# Altium project 7797-20-0224.PrjPcb
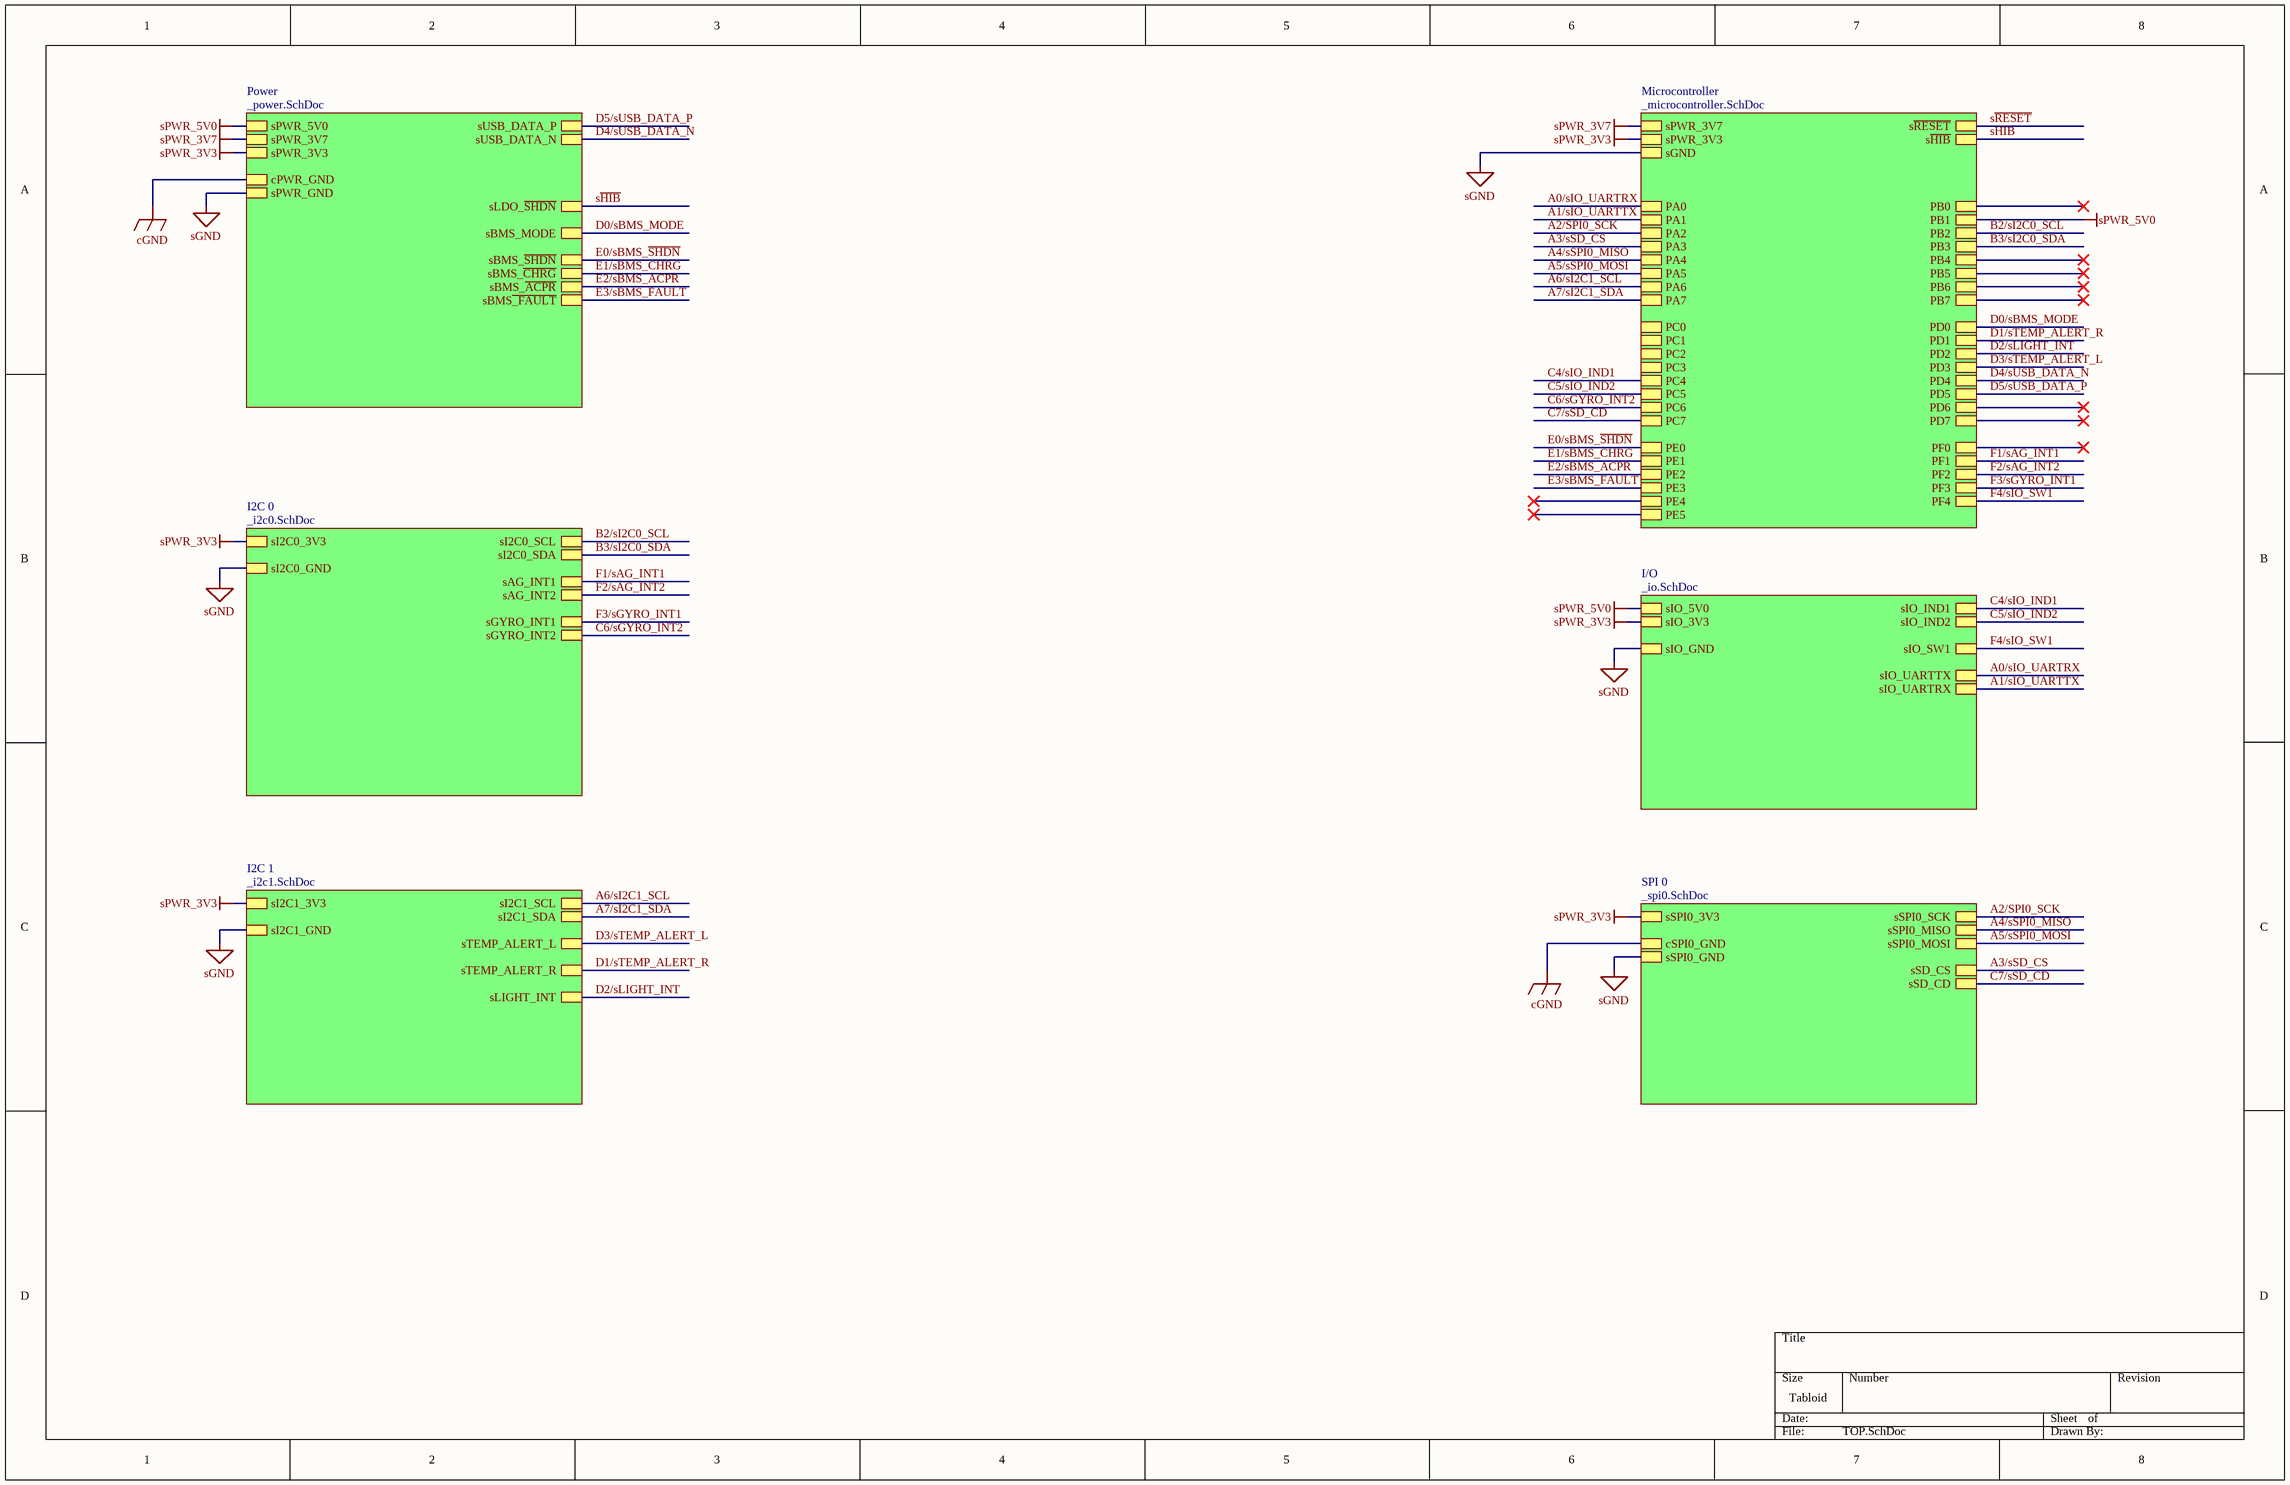
[diagram p0: TOP.SchDoc]
12 sheets, 114 parts. Net scope: strictly hierarchical (ports join the sheet entries above them; power ports are local).
Board file: 7797-20-0224.PcbDoc
Sheets:
  TOP.SchDoc
    Microcontroller = _microcontroller.SchDoc
    Power = _power.SchDoc
    I2C 0 = _i2c0.SchDoc
      Accelerometer and Mangnetometer = _accel_mag.SchDoc
      Gyroscope = _gyroscope.SchDoc
    I2C 1 = _i2c1.SchDoc
      Light And Humidity = _light_humid.SchDoc
      Temperature Left = _temperature.SchDoc
      Temperature Right = _temperature.SchDoc
    I/O = _io.SchDoc
    SPI 0 = _spi0.SchDoc
      Micro SD = _microsd.SchDoc

## Sheet TOP.SchDoc
size Tabloid

### Sub-sheets
I2C 0 = _i2c0.SchDoc: sI2C0_3V3, sI2C0_GND, sI2C0_SCL, sI2C0_SDA, sAG_INT1, sAG_INT2, sGYRO_INT1, sGYRO_INT2
I2C 1 = _i2c1.SchDoc: sI2C1_3V3, sI2C1_GND, sTEMP_ALERT_L, sLIGHT_INT, sTEMP_ALERT_R, sI2C1_SCL, sI2C1_SDA
I/O = _io.SchDoc: sIO_3V3, sIO_GND, sIO_IND1, sIO_IND2, sIO_SW1, sIO_5V0, sIO_UARTTX, sIO_UARTRX
Microcontroller = _microcontroller.SchDoc: s~{RESET}, PA0, PA1, PA2, PA3, PA4, PA5, PA6, PA7, PC0, PC1, PC2, PC3, PC4, PC5, PC6, PC7, PE0, PE1, PE2, PE3, PE4, PE5, PB0, PB1, PB2, PB3, PB4, PB5, PB6, PB7, PD0, PD1, PD2, PD3, PD4, PD5, PD6, PD7, PF0, PF1, PF2, PF3, PF4, sGND, sPWR_3V3, s~{HIB}, sPWR_3V7
Power = _power.SchDoc: sUSB_DATA_P, sUSB_DATA_N, sPWR_3V7, sPWR_3V3, sPWR_GND, cPWR_GND, sPWR_5V0, sLDO_~{SHDN}, sBMS_MODE, sBMS_~{SHDN}, sBMS_~{CHRG}, sBMS_~{ACPR}, sBMS~{_FAULT}
SPI 0 = _spi0.SchDoc: sSPI0_3V3, sSPI0_GND, sSPI0_MISO, sSPI0_MOSI, sSPI0_SCK, cSPI0_GND, sSD_CS, sSD_CD

### Nets
cGND: sheet Power/cPWR_GND, sheet SPI 0/cSPI0_GND
sGND: sheet Microcontroller/sGND, sheet Power/sPWR_GND, sheet I2C 0/sI2C0_GND, sheet I2C 1/sI2C1_GND, sheet I/O/sIO_GND, sheet SPI 0/sSPI0_GND
sPWR_3V3: sheet Microcontroller/sPWR_3V3, sheet Power/sPWR_3V3, sheet I2C 0/sI2C0_3V3, sheet I2C 1/sI2C1_3V3, sheet I/O/sIO_3V3, sheet SPI 0/sSPI0_3V3
sPWR_3V7: sheet Microcontroller/sPWR_3V7, sheet Power/sPWR_3V7
sPWR_5V0: sheet Microcontroller/PB1, sheet Power/sPWR_5V0, sheet I/O/sIO_5V0
A0/sIO_UARTRX: sheet Microcontroller/PA0, sheet I/O/sIO_UARTTX
A1/sIO_UARTTX: sheet Microcontroller/PA1, sheet I/O/sIO_UARTRX
A2/SPI0_SCK: sheet Microcontroller/PA2, sheet SPI 0/sSPI0_SCK
A3/sSD_CS: sheet Microcontroller/PA3, sheet SPI 0/sSD_CS
A4/sSPI0_MISO: sheet Microcontroller/PA4, sheet SPI 0/sSPI0_MISO
A5/sSPI0_MOSI: sheet Microcontroller/PA5, sheet SPI 0/sSPI0_MOSI
A6/sI2C1_SCL: sheet Microcontroller/PA6, sheet I2C 1/sI2C1_SCL
A7/sI2C1_SDA: sheet Microcontroller/PA7, sheet I2C 1/sI2C1_SDA
B2/sI2C0_SCL: sheet Microcontroller/PB2, sheet I2C 0/sI2C0_SCL
B3/sI2C0_SDA: sheet Microcontroller/PB3, sheet I2C 0/sI2C0_SDA
C4/sIO_IND1: sheet Microcontroller/PC4, sheet I/O/sIO_IND1
C5/sIO_IND2: sheet Microcontroller/PC5, sheet I/O/sIO_IND2
C6/sGYRO_INT2: sheet Microcontroller/PC6, sheet I2C 0/sGYRO_INT2
C7/sSD_CD: sheet Microcontroller/PC7, sheet SPI 0/sSD_CD
D0/sBMS_MODE: sheet Microcontroller/PD0, sheet Power/sBMS_MODE
D1/sTEMP_ALERT_R: sheet Microcontroller/PD1, sheet I2C 1/sTEMP_ALERT_R
D2/sLIGHT_INT: sheet Microcontroller/PD2, sheet I2C 1/sLIGHT_INT
D3/sTEMP_ALERT_L: sheet Microcontroller/PD3, sheet I2C 1/sTEMP_ALERT_L
D4/sUSB_DATA_N: sheet Microcontroller/PD4, sheet Power/sUSB_DATA_N
D5/sUSB_DATA_P: sheet Microcontroller/PD5, sheet Power/sUSB_DATA_P
E0/sBMS_~{SHDN}: sheet Microcontroller/PE0, sheet Power/sBMS_~{SHDN}
E1/sBMS_~{CHRG}: sheet Microcontroller/PE1, sheet Power/sBMS_~{CHRG}
E2/sBMS_~{ACPR}: sheet Microcontroller/PE2, sheet Power/sBMS_~{ACPR}
E3/sBMS~{_FAULT}: sheet Microcontroller/PE3, sheet Power/sBMS~{_FAULT}
F1/sAG_INT1: sheet Microcontroller/PF1, sheet I2C 0/sAG_INT1
F2/sAG_INT2: sheet Microcontroller/PF2, sheet I2C 0/sAG_INT2
F3/sGYRO_INT1: sheet Microcontroller/PF3, sheet I2C 0/sGYRO_INT1
F4/sIO_SW1: sheet Microcontroller/PF4, sheet I/O/sIO_SW1
s~{HIB}: sheet Microcontroller/s~{HIB}, sheet Power/sLDO_~{SHDN}

## Sheet _microcontroller.SchDoc
size Tabloid
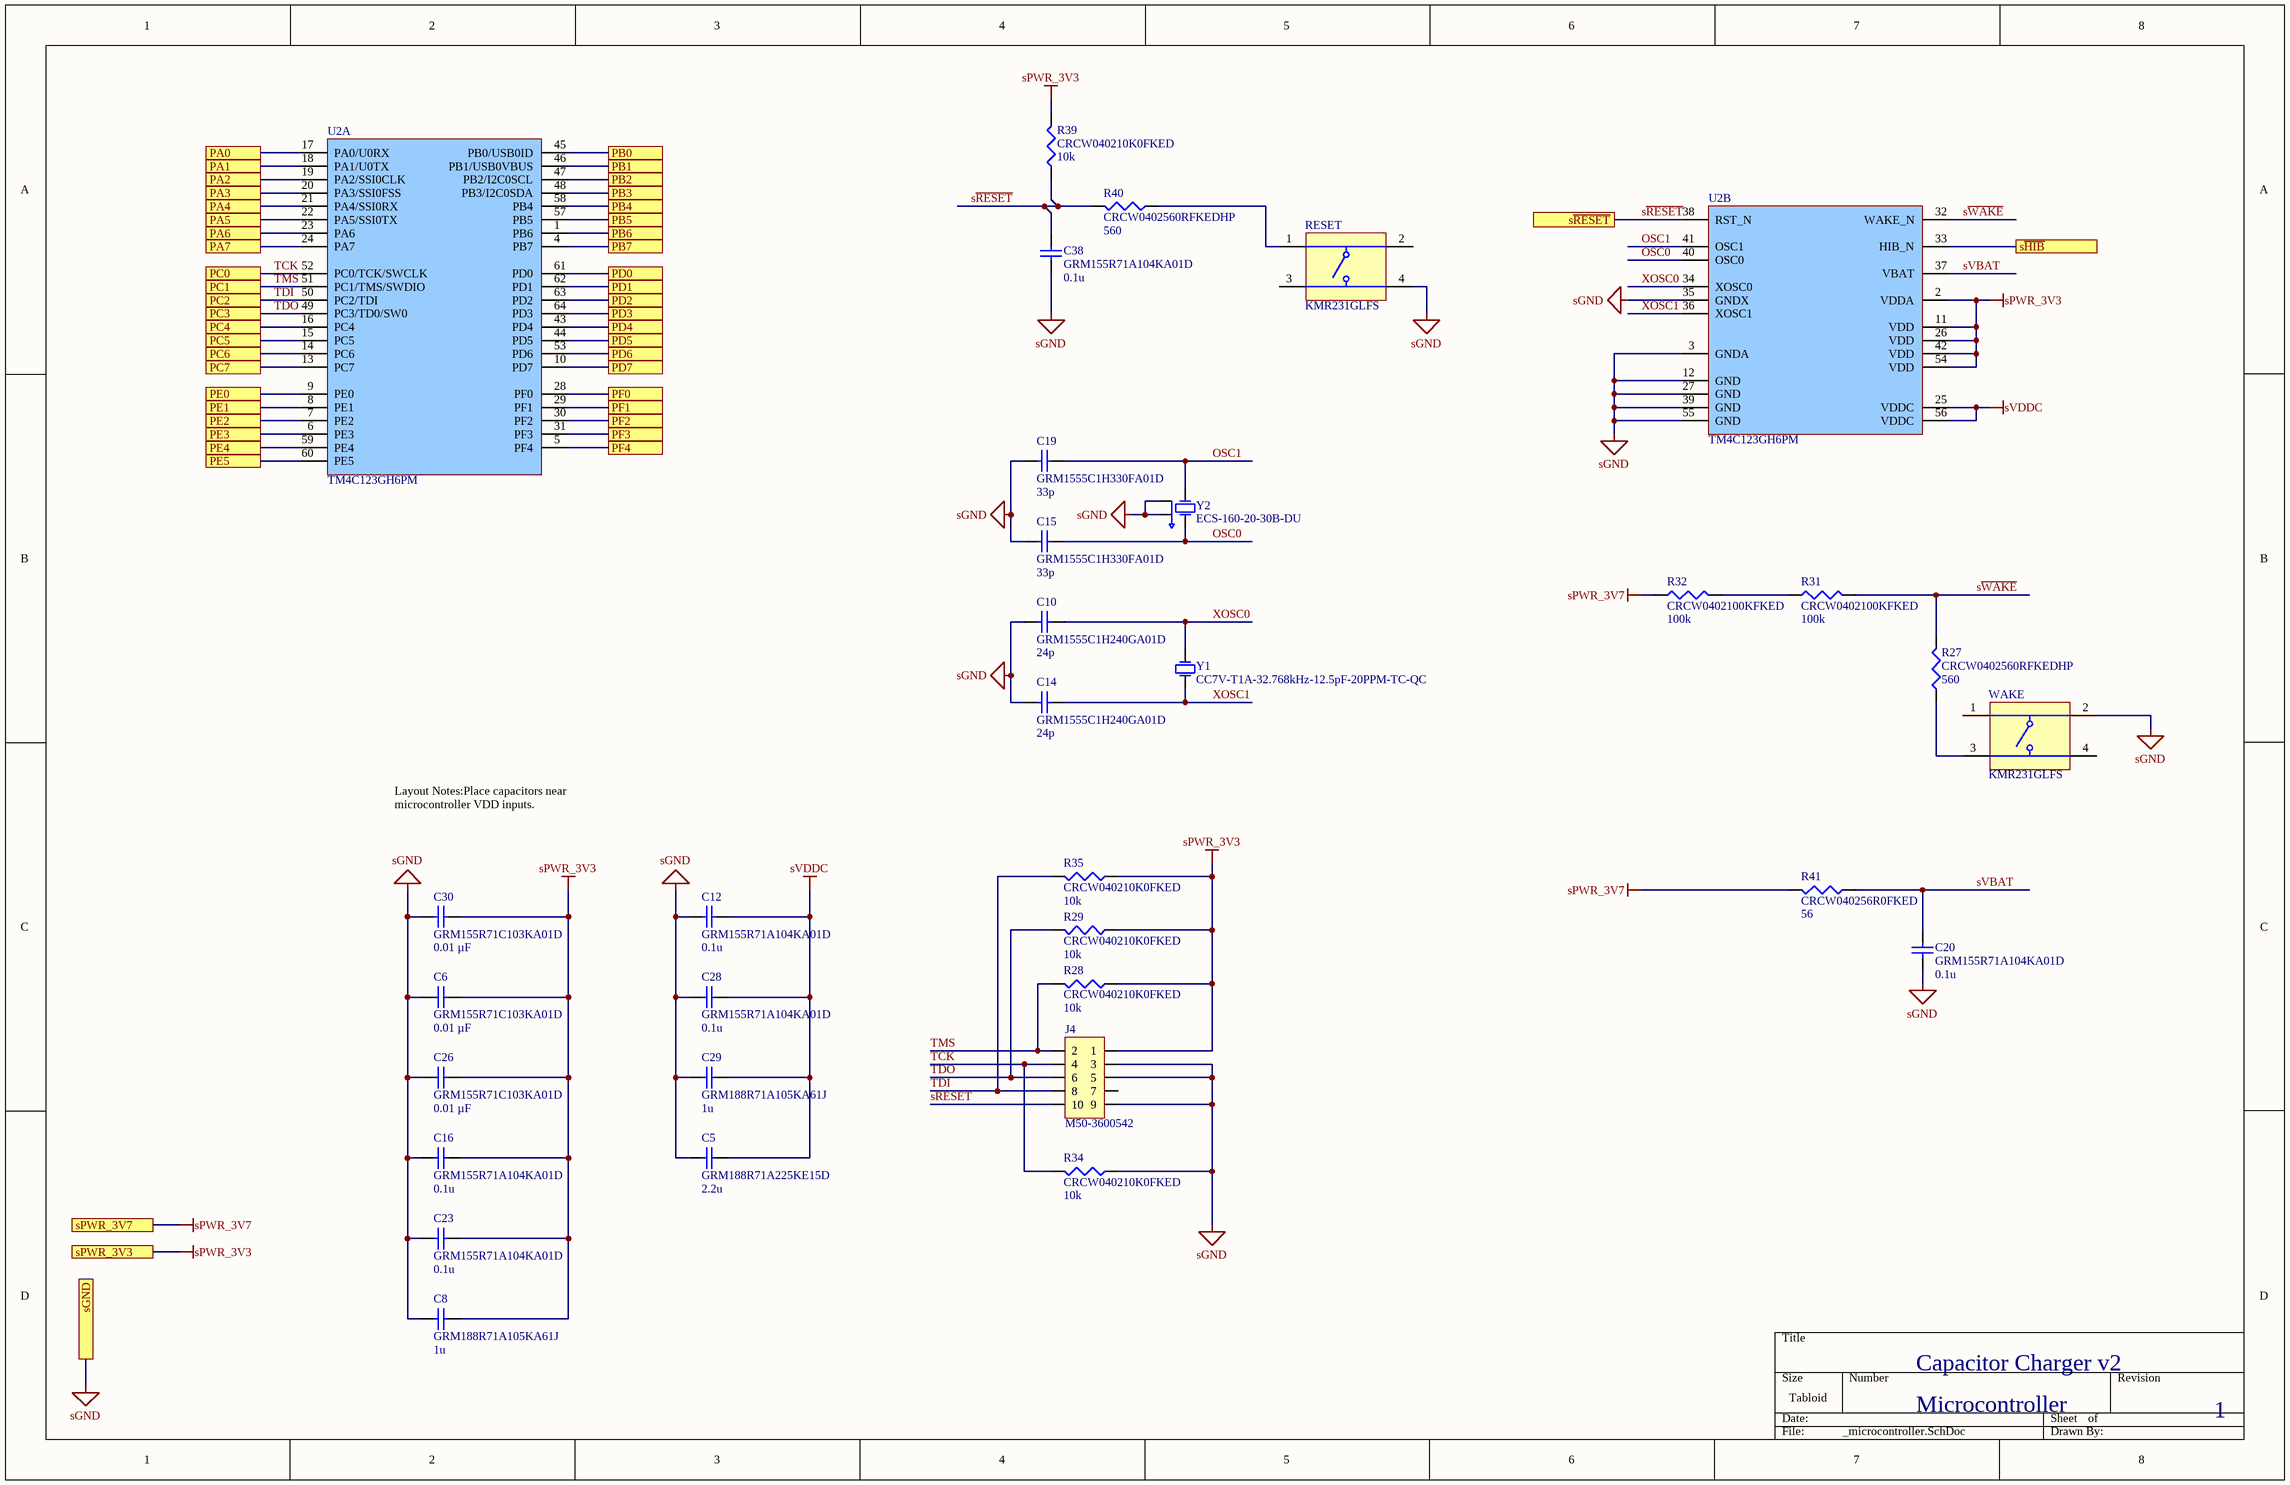
[diagram p1: _microcontroller.SchDoc]

### Parts
(Parts that share a designator on the sheet are numbered #1, #2 ... from top to bottom, then left to right.)
C5  GRM188R71A225KE15D  value 2.2u  [0603]
C6  GRM155R71C103KA01D  value 0.01 µF  [0402]
C8  GRM188R71A105KA61J  value 1u  [0603]
C10  GRM1555C1H240GA01D  value 24p  [0402]
C12  GRM155R71A104KA01D  value 0.1u  [0402]
C14  GRM1555C1H240GA01D  value 24p  [0402]
C15  GRM1555C1H330FA01D  value 33p  [0402]
C16  GRM155R71A104KA01D  value 0.1u  [0402]
C19  GRM1555C1H330FA01D  value 33p  [0402]
C20  GRM155R71A104KA01D  value 0.1u  [0402]
C23  GRM155R71A104KA01D  value 0.1u  [0402]
C26  GRM155R71C103KA01D  value 0.01 µF  [0402]
C28  GRM155R71A104KA01D  value 0.1u  [0402]
C29  GRM188R71A105KA61J  value 1u  [0603]
C30  GRM155R71C103KA01D  value 0.01 µF  [0402]
C38#1  GRM155R71A104KA01D  value 0.1u  [0402]
J4  M50-3600542  [M50-3600542]
R27  CRCW0402560RFKEDHP  value 560  [0402]
R28  CRCW040210K0FKED  value 10k  [0402]
R29  CRCW040210K0FKED  value 10k  [0402]
R31  CRCW0402100KFKED  value 100k  [0402]
R32  CRCW0402100KFKED  value 100k  [0402]
R34  CRCW040210K0FKED  value 10k  [0402]
R35  CRCW040210K0FKED  value 10k  [0402]
R39  CRCW040210K0FKED  value 10k  [0402]
R40  CRCW0402560RFKEDHP  value 560  [0402]
R41  CRCW040256R0FKED  value 56  [0402]
RESET  KMR231GLFS  [KMR231GLFS]
U2  TM4C123GH6PM  [QFP50P1200X1200X160-64N]  (parts A,B of 2)
WAKE  KMR231GLFS  [KMR231GLFS]
Y1  CC7V-T1A-32.768kHz-12.5pF-20PPM-TC-QC  [CC7V-T1A]
Y2  ECS-160-20-30B-DU  [ECX-53B]

### Ports
PA0, PA1, PA2, PA3, PA4, PA5, PA6, PA7, PB0, PB1, PB2, PB3, PB4, PB5, PB6, PB7, PC0, PC1, PC2, PC3, PC4, PC5, PC6, PC7, PD0, PD1, PD2, PD3, PD4, PD5, PD6, PD7, PE0, PE1, PE2, PE3, PE4, PE5, PF0, PF1, PF2, PF3, PF4, sGND, sPWR_3V3, sPWR_3V7, s~{HIB}, s~{RESET}

### Nets
sGND: C5.2 C6.2 C8.2 C10.1 C12.2 C14.1 C15.1 C16.2 C19.1 C20.2 C23.2 C26.2 C28.2 C29.2 C30.2 C38#1.2 J4.3 J4.5 J4.9 R34.1 RESET.4 U2.3(GNDA) U2.12(GND) U2.27(GND) U2.35(GNDX) U2.39(GND) U2.55(GND) WAKE.2 Y2.2 Y2.4 ; port sGND
sPWR_3V3: C6.1 C8.1 C16.1 C23.1 C26.1 C30.1 J4.1 R28.1 R29.1 R35.1 R39.2 U2.2(VDDA) U2.11(VDD) U2.26(VDD) U2.42(VDD) U2.54(VDD) ; port sPWR_3V3
sPWR_3V7: R32.1 R41.2 ; port sPWR_3V7
sPWR_5V0: U2.46(PB1/USB0VBUS) ; port PB1
sVDDC: C5.1 C12.1 C28.1 C29.1 U2.25(VDDC) U2.56(VDDC)
A0/sIO_UARTRX: U2.17(PA0/U0RX) ; port PA0
A1/sIO_UARTTX: U2.18(PA1/U0TX) ; port PA1
A2/SPI0_SCK: U2.19(PA2/SSI0CLK) ; port PA2
A3/sSD_CS: U2.20(PA3/SSI0FSS) ; port PA3
A4/sSPI0_MISO: U2.21(PA4/SSI0RX) ; port PA4
A5/sSPI0_MOSI: U2.22(PA5/SSI0TX) ; port PA5
A6/sI2C1_SCL: U2.23(PA6) ; port PA6
A7/sI2C1_SDA: U2.24(PA7) ; port PA7
B2/sI2C0_SCL: U2.47(PB2/I2C0SCL) ; port PB2
B3/sI2C0_SDA: U2.48(PB3/I2C0SDA) ; port PB3
C4/sIO_IND1: U2.16(PC4) ; port PC4
C5/sIO_IND2: U2.15(PC5) ; port PC5
C6/sGYRO_INT2: U2.14(PC6) ; port PC6
C7/sSD_CD: U2.13(PC7) ; port PC7
D0/sBMS_MODE: U2.61(PD0) ; port PD0
D1/sTEMP_ALERT_R: U2.62(PD1) ; port PD1
D2/sLIGHT_INT: U2.63(PD2) ; port PD2
D3/sTEMP_ALERT_L: U2.64(PD3) ; port PD3
D4/sUSB_DATA_N: U2.43(PD4) ; port PD4
D5/sUSB_DATA_P: U2.44(PD5) ; port PD5
E0/sBMS_~{SHDN}: U2.9(PE0) ; port PE0
E1/sBMS_~{CHRG}: U2.8(PE1) ; port PE1
E2/sBMS_~{ACPR}: U2.7(PE2) ; port PE2
E3/sBMS~{_FAULT}: U2.6(PE3) ; port PE3
F1/sAG_INT1: U2.29(PF1) ; port PF1
F2/sAG_INT2: U2.30(PF2) ; port PF2
F3/sGYRO_INT1: U2.31(PF3) ; port PF3
F4/sIO_SW1: U2.5(PF4) ; port PF4
OSC0: C15.2 U2.40(OSC0) Y2.3
OSC1: C19.2 U2.41(OSC1) Y2.1
PB0: U2.45(PB0/USB0ID) ; port PB0
PB4: U2.58(PB4) ; port PB4
PB5: U2.57(PB5) ; port PB5
PB6: U2.1(PB6) ; port PB6
PB7: U2.4(PB7) ; port PB7
PD6: U2.53(PD6) ; port PD6
PD7: U2.10(PD7) ; port PD7
PE4: U2.59(PE4) ; port PE4
PE5: U2.60(PE5) ; port PE5
PF0: U2.28(PF0) ; port PF0
s~{HIB}: U2.33(HIB_N) ; port s~{HIB}
s~{RESET}: C38#1.1 J4.10 R39.1 R40.2 U2.38(RST_N) ; port s~{RESET}
sVBAT: C20.1 R41.1 U2.37(VBAT)
s~{WAKE}: R27.2 R31.2 U2.32(WAKE_N)
TCK: J4.4 R34.2 U2.52(PC0/TCK/SWCLK) ; port PC0
TDI: J4.8 R35.2 U2.50(PC2/TDI) ; port PC2
TDO: J4.6 R29.2 U2.49(PC3/TD0/SW0) ; port PC3
TMS: J4.2 R28.2 U2.51(PC1/TMS/SWDIO) ; port PC1
XOSC0: C10.2 U2.34(XOSC0) Y1.1
XOSC1: C14.2 U2.36(XOSC1) Y1.2
NetR27_1: R27.1 WAKE.3
NetR31_1: R31.1 R32.2
NetR40_1: R40.1 RESET.1

Not connected (* = marked no-connect by the designer): J4 7; RESET 2 3; WAKE 1 4

### Notes on the sheet
- Layout Notes:Place capacitors near microcontroller VDD inputs.
- Capacitor Charger v2
- Microcontroller
- 1

### Library data of the parts
C5 C8 C29 = GRM188R71AxxxKdddd: -55-125C, 1608, 10V, X7R, ±10%
C6 C26 C30 = Cap: Cap, 0.01 µF, 16 V, X7R; Published: 8-Jun-2000; LatestRevisionDate: 17-Jul-2002; LatestRevisionNote: Re-released for DXP Platform.; PackageReference: RAD-0.3; Publisher: Altium Limited; PackageDescription: Radial Cap, Thru-Hole; 2 Leads; 0.3 in Pin Spacing
C10 C14 C15 C19 = Cap Semi: Capacitor (Semiconductor SIM Model); Published: 8-Jun-2000; LatestRevisionDate: 29-May-2009; LatestRevisionNote: IPC-7351 Footprint Added.; PackageReference: C1206; Publisher: Altium Limited; PackageDescription: Chip Capacitor
C12 C16 C20 C23 C28 C38#1 = GRM155R71AxxxKdddd: -55-125C, 1005, 10V, X7R, ±10%
R27-R29 R31 R32 R34 R35 R39-R41 = CRCW0402xxxxFKED: 0.125W, -55-155C, 1005, 50V, ±1%
RESET WAKE = KMR231GLFS: Switch Tactile, SPST, 50 mA, 32 V, -40 to 85 degC, 4-Pin SMD, RoHS, Tape and Reel; Manufacturer: C&K Components; Mechanical Life: 150000Cycles; Switch Configuration: N.O.; Actuator Style: Button; Ground Terminal: Yes; Maximum DC Voltage Rating: 32V; Minimum Insulation Resistance: >=1000MOhm; Dielectric Strength: >=250Vrms; Operating Force: 3N; Illumination Type: N/R; Body Orientation: Straight; Contact Rating @ Voltage: 1A; Actuator Length: 0.5mm; Operating Temperature: -40to85C; Electrical Life: N/A; Housing Material: N/A; ECCN: EAR99; Pole Throw Configuration: SPST; Contact Plating: Silver; Dimension: 2.8x4.6x1.9mm; Type: Micro-Miniature; Product Weight: N/A; Package Description: 4-Pin Surface Mount Device, Body 4.6 x 2.8 mm; Actuator Color: N/A; HTS: 8536501199; Mounting Technology: SurfaceMount; Mounting: SurfaceMount,GullWing; Seal Location: N/A; Base Material: N/A; Family: KMR2; Part No: KMR231GLFS; Datasheet Version: 06/2016; Contact Material: Silver; Package Reference: KMR231GLFS; Manufacturer URL: http://www.ckswitches.com/; Maximum AC Voltage Rating: N/A; Datasheet URL: http://www.ck-components.com/media/1479/kmr2.pdf; RoHS: Yes; Seal Description: N/A; Packaging: TapeandReel; Supplier: C&KComponents
U2 = TM4C123GH6PM: Tiva TM4C123GH6PM Microcontroller
Y1 = CC7V-T1A: Crystals 32.768 kHz 12.5 pF +/-20 PPM -55/+125C
Y2 = ECS-160-20-30B-DU: Crystal, 16.000MHz, 20pF, 100ppm, -55 to 125 C, 60 Ω

## Sheet _power.SchDoc
size Tabloid
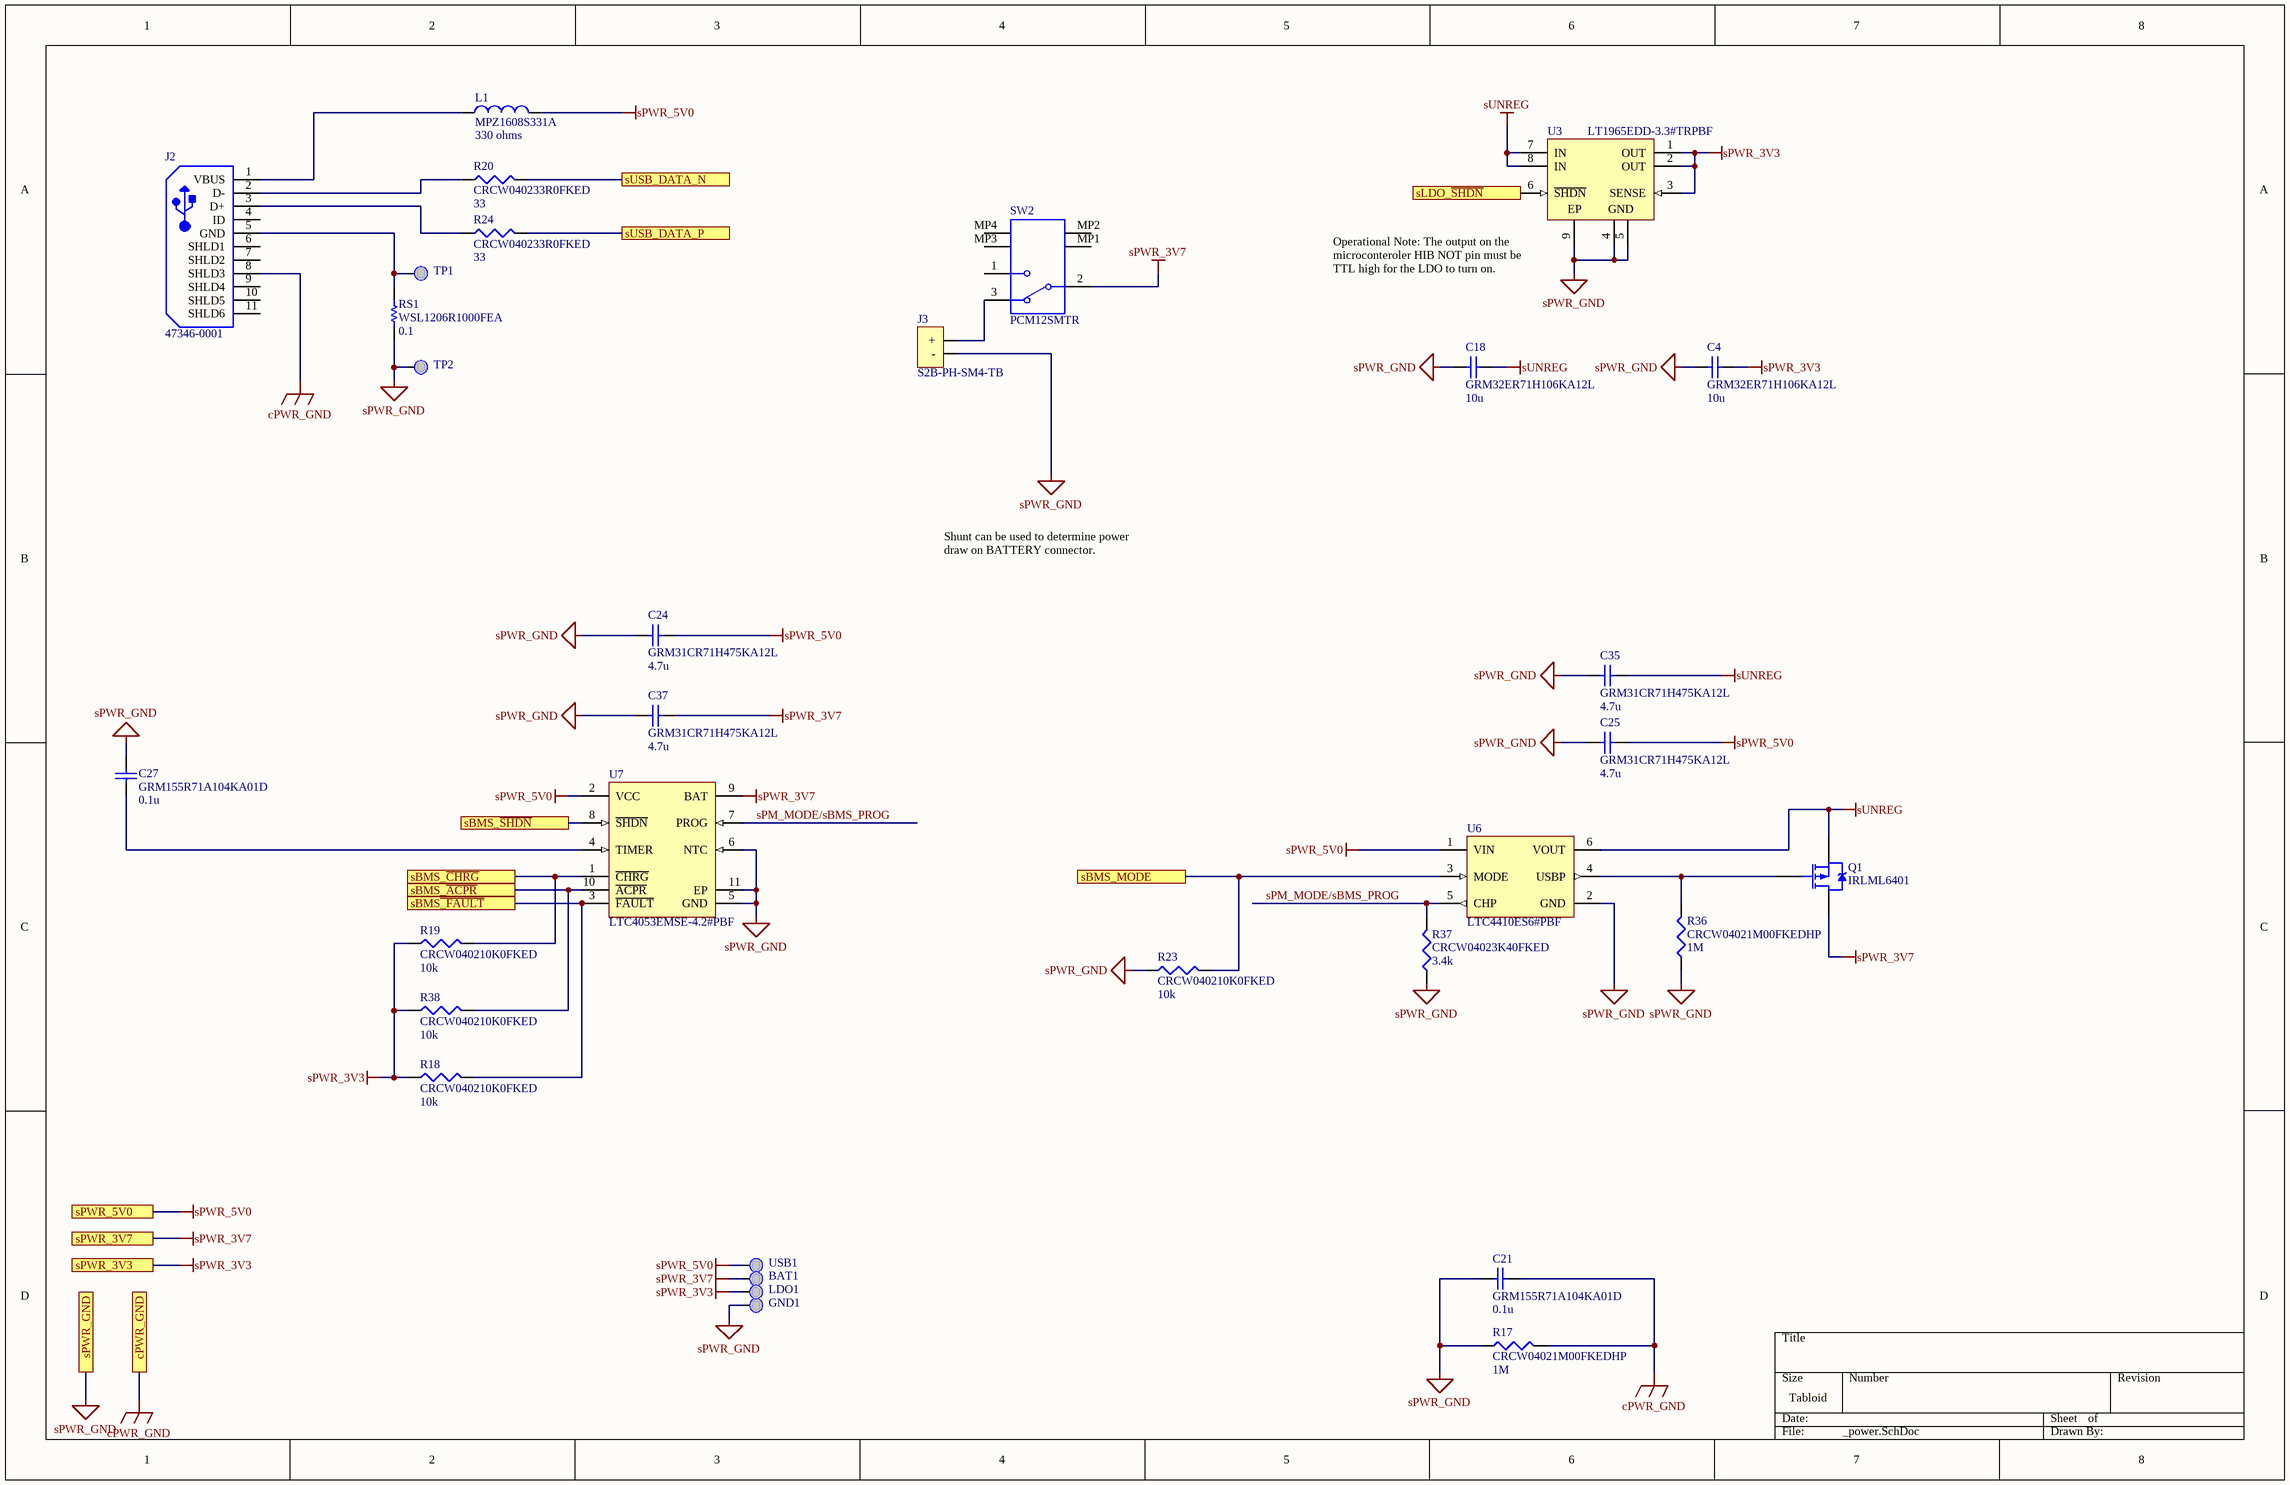
[diagram p2: _power.SchDoc]

### Parts
(Parts that share a designator on the sheet are numbered #1, #2 ... from top to bottom, then left to right.)
BAT1  TP  [TP_TH]  (value not drawn)
C4  GRM32ER71H106KA12L  value 10u  [1210]
C18  GRM32ER71H106KA12L  value 10u  [1210]
C21  GRM155R71A104KA01D  value 0.1u  [0402]
C24  GRM31CR71H475KA12L  value 4.7u  [1206]
C25  GRM31CR71H475KA12L  value 4.7u  [1206]
C27  GRM155R71A104KA01D  value 0.1u  [0402]
C35  GRM31CR71H475KA12L  value 4.7u  [1206]
C37  GRM31CR71H475KA12L  value 4.7u  [1206]
GND1  TP  [TP_TH]  (value not drawn)
J2  47346-0001  [MOLX-47346-0001-5_V]
J3  S2B-PH-SM4-TB  [S2B-PH-SM4-TB]
L1  MPZ1608S331A  value 330 ohms  [1608[0603]]
LDO1  TP  [TP_TH]  (value not drawn)
Q1  IRLML6401  [Micro3_N]
R17  CRCW04021M00FKEDHP  value 1M  [0402]
R18  CRCW040210K0FKED  value 10k  [0402]
R19  CRCW040210K0FKED  value 10k  [0402]
R20  CRCW040233R0FKED  value 33  [0402]
R23  CRCW040210K0FKED  value 10k  [0402]
R24  CRCW040233R0FKED  value 33  [0402]
R36#1  CRCW04021M00FKEDHP  value 1M  [0402]
R37  CRCW04023K40FKED  value 3.4k  [0402]
R38  CRCW040210K0FKED  value 10k  [0402]
RS1  WSL1206R1000FEA  value 0.1  [C1206]
SW2  PCM12SMTR  [CKCP-PCM12SMTR_V]
TP1  TP  [TP_TH]  (value not drawn)
TP2  TP  [TP_TH]  (value not drawn)
U3  LT1965EDD-3.3#TRPBF  [LT-DD-8_V]
U6  LTC4410ES6#PBF  [LT-S6-6-TSOT-23_N]
U7  LTC4053EMSE-4.2#PBF  [LT-MSE-10-EDP-2060x1830TP_N]
USB1  TP  [TP_TH]  (value not drawn)

### Ports
cPWR_GND, sBMS_MODE, sBMS_~{ACPR}, sBMS_~{CHRG}, sBMS_~{SHDN}, sBMS~{_FAULT}, sLDO_~{SHDN}, sPWR_3V3, sPWR_3V7, sPWR_5V0, sPWR_GND, sUSB_DATA_N, sUSB_DATA_P

### Nets
cPWR_GND: C21.2 J2.8(SHLD3) R17.2 ; port cPWR_GND  [project net cGND]
sPWR_3V3: C4.2 LDO1.1 R18.1 R19.1 R38.1 U3.1(OUT) U3.2(OUT) U3.3(SENSE) ; port sPWR_3V3
sPWR_3V7: BAT1.1 C37.2 Q1.3(D) SW2.2 U7.9(BAT) ; port sPWR_3V7
sPWR_5V0: C24.2 C25.2 L1.2 U6.1(VIN) U7.2(VCC) USB1.1 ; port sPWR_5V0
sPWR_GND: C4.1 C18.1 C21.1 C24.1 C25.1 C27.1 C35.1 C37.1 GND1.1 J3.1(-) R17.1 R23.1 R36#1.1 R37.1 RS1.1 TP2.1 U3.4(GND) U3.5(GND) U3.9(EP) U6.2(GND) U7.5(GND) U7.6(NTC) U7.11(EP) ; port sPWR_GND  [project net sGND]
sUNREG: C18.2 C35.2 Q1.2(S) U3.7(IN) U3.8(IN) U6.6(VOUT)
D0/sBMS_MODE: R23.2 U6.3(MODE) ; port sBMS_MODE
D4/sUSB_DATA_N: R20.2 ; port sUSB_DATA_N
D5/sUSB_DATA_P: R24.2 ; port sUSB_DATA_P
E0/sBMS_~{SHDN}: U7.8(~{SHDN}) ; port sBMS_~{SHDN}
E1/sBMS_~{CHRG}: R19.2 U7.1(~{CHRG}) ; port sBMS_~{CHRG}
E2/sBMS_~{ACPR}: R38.2 U7.10(~{ACPR}) ; port sBMS_~{ACPR}
E3/sBMS~{_FAULT}: R18.2 U7.3(~{FAULT}) ; port sBMS~{_FAULT}
s~{HIB}: U3.6(~{SHDN}) ; port sLDO_~{SHDN}
sPM_MODE/sBMS_PROG: R37.2 U6.5(CHP) U7.7(PROG)
NetC27_2: C27.2 U7.4(TIMER)
NetJ2_1: J2.1(VBUS) L1.1
NetJ2_2: J2.2(D-) R20.1
NetJ2_3: J2.3(D+) R24.1
NetJ2_5: J2.5(GND) RS1.2 TP1.1
NetJ3_2: J3.2(+) SW2.3
NetQ1_1: Q1.1(G) R36#1.2 U6.4(USBP)

Not connected (* = marked no-connect by the designer): J2 4(ID) 6(SHLD1) 7(SHLD2) 9(SHLD4) 10(SHLD5) 11(SHLD6); SW2 1 MP1 MP2 MP3 MP4

### Notes on the sheet
- (near U3) Operational Note: The output on the microconteroler HIB NOT pin must be TTL high for the LDO to turn on.
- Shunt can be used to determine power draw on BATTERY connector.

### Library data of the parts
C4 C18 = GRM32ER71HxxxKdddd: -55-125C, 1005, 50V, X7R, ±10%
C21 C27 = GRM155R71AxxxKdddd: -55-125C, 1005, 10V, X7R, ±10%
C24 C25 C35 C37 = GRM31CR71HxxxKdddd: -55-125C, 3216, 50V, X7R, ±10%
J2 = CMP-2000-05246-1: Micro-USB B Receptacle with Flange, -30 to 85 degC, 5-Pin SMD, RoHS, Tape and Reel; Manufacturer: Molex; Number of Contacts: 5; Body Orientation: RightAngle; Maximum Voltage Rating: 30VAC; Pitch: 0.65mm; Maximum Current Rating: 1.8/ContactA; Number of Ports: 1; Gender: RCP; Operating Temperature: -30to85C; Part No: 47346-0001; Color: Black; Termination Method: Solder; Contact Plating: GoldOverPalladiumNickelOverNickel; Dimension: 7.8x5.43x2.94mm; Number of Terminals: 5; Datasheet Version: Dec-13; Datasheet URL: https://datasheet.ciiva.com/30075/304740473460001-io-nectors-30075527.pdf; Contact Material: CopperAlloy; RoHS: Yes; Housing Material: LiquidCrystalPolymer; Manufacturer URL: http://www.molex.com/; Packaging: EmbossedTapeandReel; Mounting: SurfaceMount; Type: MicroUSBTypeB
J3 = S2B-PH-SM4-TB: JST Battery Connector
L1 = Inductor: EMI Filter Beads, Chips & Arrays 0603 330ohms 100MHz Rdc 0.08ohms 1.7A; Code_IEC: 1005; Published: 8-Jun-2000; LatestRevisionDate: 29-May-2009; LatestRevisionNote: IPC-7351 Footprint Added.; PackageReference: 0402-A; Publisher: Altium Limited; PackageDescription: Chip Inductor; Code_JEITA: 0402
Q1 = IRLML6401: MOSFET P-CH 12V 4.3A SOT-23; Published: 17-Sep-2003; DatasheetVersion: 2-Jul-2001; PackageVersion: Jul-2001; PackageReference: Micro3; Publisher: Altium Limited; PackageDescription: 3-Pin SOT-23 Package 0.95 mm Pitch, 2.3 mm Lead Span; ComponentLink1Description: Manufacturer Link; ComponentLink1URL: http://www.irf.com/; ComponentLink2Description: Datasheet; ComponentLink2URL: http://www.irf.com/product-info/datasheets/data/IRLML6401.pdf
R17-R20 R23 R24 R36#1 R37 R38 = CRCW0402xxxxFKED: 0.125W, -55-155C, 1005, 50V, ±1%
RS1 = Res Semi: Current Sense Resistors - SMD 1/4watt .1ohms 1%; Published: 8-Jun-2000; LatestRevisionDate: 17-Jul-2002; LatestRevisionNote: Re-released for DXP Platform.; PackageReference: AXIAL-0.5; Publisher: Altium Limited; PackageDescription: Axial Device, Thru-Hole; 2 Leads; 0.5 in Pin Spacing
SW2 = CMP-2000-06884-1: Ultraminiature Slide Switch, SPDT, 0.3 A, 6 V, -20 to 85 degC, 3-Pin SMD, RoHS, Tape and Reel; Manufacturer: C&K Components; Switch Operation: On-On; Contact Current-Max: 0.3A; Datasheet Version: 02/2016; Package Reference: PCM12SMTR; Package Description: 3-Pin Surface Mount Device, Body 6.7 x 2.6 mm; Contact Material: SilverOverCopper; Mounting Technology: SurfaceMount; Circuitry: SPDT; Datasheet URL: http://www.ck-components.com/media/1424/pcm.pdf; Termination Style: RightAngle/SurfaceMount; Manufacturer URL: http://www.ckswitches.com/
U3 = CMP-0476-00225-1: 1.1 A, Low Noise, Low Dropout Linear Regulator, 1.8 to 20 V Vin, 3.3 V Vout, 8-pin SON (DD-8), -40 to 125 degC, Pb-Free, Tape and Reel; Manufacturer: Linear Technology; Number of Outputs: 1; Iout(mA): 1100; Noise(uV): 40; Dropout Voltage(V): 0.31; Discrete Pass Element: no; Vin Max(V): 20; Output Voltage: 3.3 V; PSRR(dB): 75; Isupply(mA): 0.5; Vin Min(V): 1.8; PackageReference: DD-8; PackageDescription: 8-Pin Plastic DFN, Body 3 x 3 mm, Pitch 0.5 mm; Code_JEDEC: MO-229; ComponentLink2URL: http://cds.linear.com/docs/en/datasheet/1965fa.pdf; PackageVersion: Jun-10; ComponentLink3URL: http://cds.linear.com/docs/en/packaging/DFN_8_05-08-1698.pdf; ComponentLink2Description: Datasheet; Packing: Tape and Reel; Shutdown Current(uA): 1; PartNumber: LT1965EDD-3.3#TRPBF; ComponentLink1URL: http://www.linear.com/; RoHS: TRUE; Mounting Technology: Surface Mount; ComponentLink3Description: Package Specification; ComponentLink1Description: Manufacturer URL; DatasheetVersion: Rev. A
U6 = LTC4410ES6#PBF: USB Power Manager, 4.35 to 5.5 V Vin, 6-pin SOT23 (S6-6), -40 to 85 degC, Pb-Free; Manufacturer: Linear Technology; Ideal Diode: Single, External, P-Channel; PackageVersion: Jun-10; PackageReference: S6-6; PackageDescription: 6-Pin Plastic TSOT-23, Body 2.9 x 1.63 mm, Pitch 0.95 mm; Supplier 1: Newark; Supplier Part Number 1: 78T3424; RoHS: TRUE; Mounting Technology: Surface Mount; Code_JEDEC: MO-193; PartNumber: LTC4410ES6#PBF; ComponentLink1Description: Manufacturer URL; ComponentLink1URL: http://www.linear.com/; ComponentLink2Description: Datasheet; ComponentLink2URL: http://cds.linear.com/docs/en/datasheet/4410fs.pdf; ComponentLink3Description: Package Specification; ComponentLink3URL: http://cds.linear.com/docs/en/packaging/SOT_6_05-08-1636.pdf
U7 = LTC4053EMSE-4.2#PBF: USB Compatible Lithium-Ion Battery Charger with Thermal Regulation, 4.25 to 6.5 V Vin, 10-pin SOP (MSE-10-EDP), -40 to 85 degC, Pb-Free; Manufacturer: Linear Technology; Battery Chemistry: Li-Ion, Li-Polymer; Charge Termination: On-board timer; Float Voltage: 4.2 V; Max Charge Current(A): 1.25; Number of Cells: 1; Type of Charger: Linear; Vin Max(V): 6.5; Vin Min(V): 4.25; DatasheetVersion: Rev. A; PackageVersion: Rev. C, 08/2009; PackageReference: MSE-10; PackageDescription: 10-Pin Plastic MSOP, Exposed Die Pad, Body 3 x 3 mm, Pitch 0.5 mm; Supplier 1: Digi-Key; Supplier Part Number 1: LTC4053EMSE-4.2#PBF-ND; Supplier 2: Farnell; Supplier Part Number 2: 1663727; Supplier 3: Newark; Supplier Part Number 3: 58M0850; RoHS: TRUE; Mounting Technology: Surface Mount; PartNumber: LTC4053EMSE-4.2#PBF; ComponentLink1Description: Manufacturer URL; ComponentLink1URL: http://www.linear.com/; ComponentLink2Description: Datasheet; ComponentLink2URL: http://cds.linear.com/docs/en/datasheet/4053-4.2fs.pdf; ComponentLink3Description: Package Specification; ComponentLink3URL: http://cds.linear.com/docs/en/datasheet/3481fc.pdf

## Sheet _i2c0.SchDoc
size Tabloid
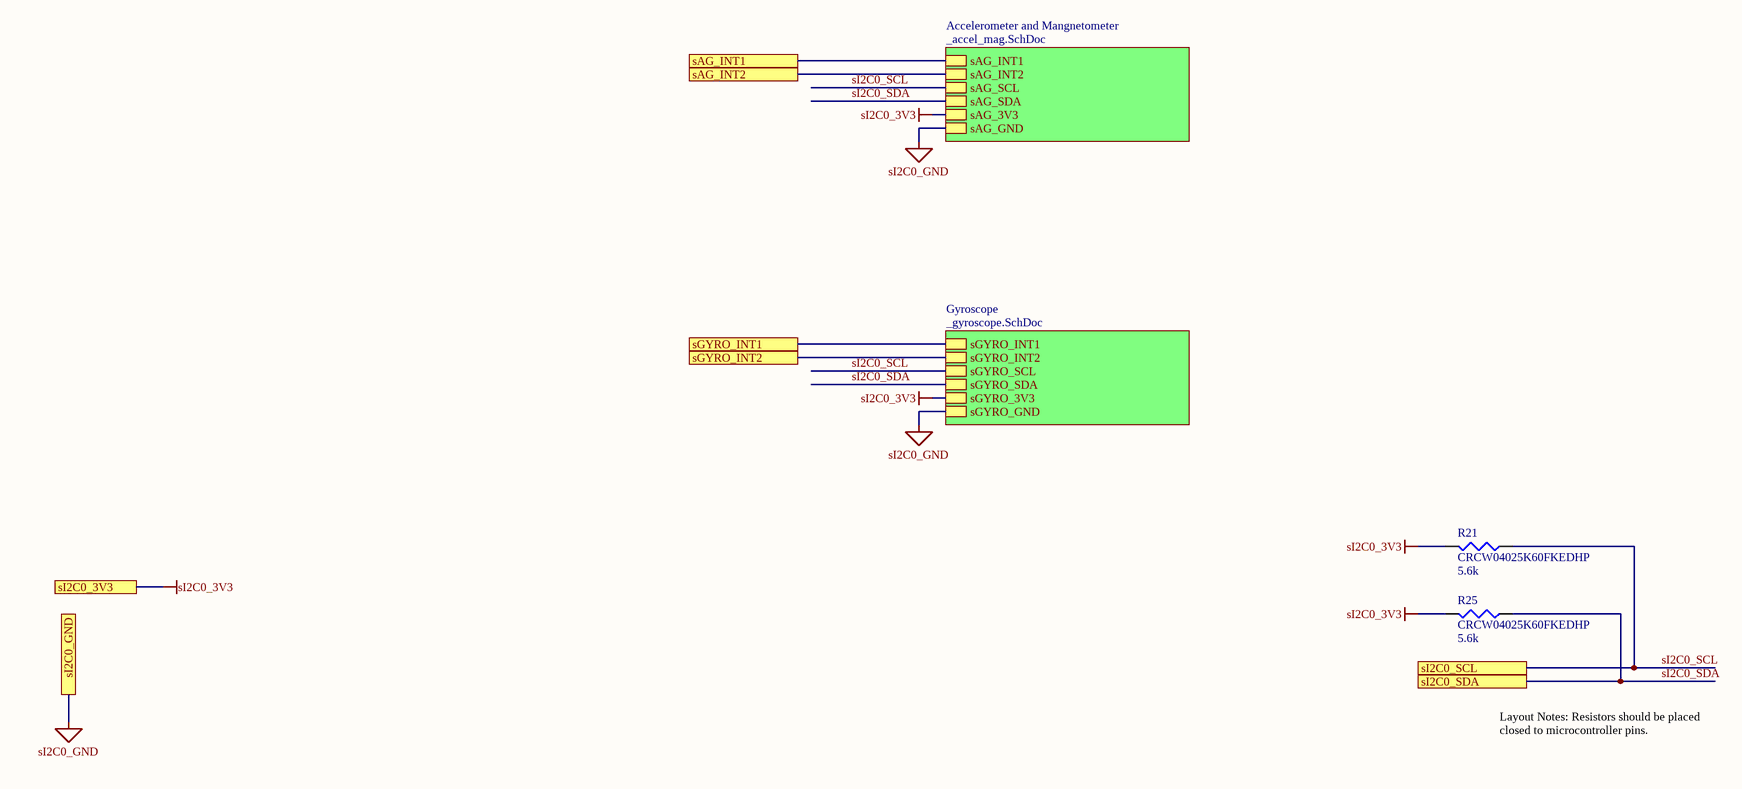
[diagram p3: _i2c0.SchDoc]

### Parts
R21  CRCW04025K60FKEDHP  value 5.6k  [0402]
R25  CRCW04025K60FKEDHP  value 5.6k  [0402]

### Sub-sheets
Accelerometer and Mangnetometer = _accel_mag.SchDoc: sAG_3V3, sAG_GND, sAG_SCL, sAG_SDA, sAG_INT1, sAG_INT2
Gyroscope = _gyroscope.SchDoc: sGYRO_3V3, sGYRO_GND, sGYRO_INT1, sGYRO_INT2, sGYRO_SCL, sGYRO_SDA

### Ports
sAG_INT1, sAG_INT2, sGYRO_INT1, sGYRO_INT2, sI2C0_3V3, sI2C0_GND, sI2C0_SCL, sI2C0_SDA

### Nets
sI2C0_3V3: R21.2 R25.2 ; port sI2C0_3V3, sheet Accelerometer and Mangnetometer/sAG_3V3, sheet Gyroscope/sGYRO_3V3  [project net sPWR_3V3]
sI2C0_GND: port sI2C0_GND, sheet Accelerometer and Mangnetometer/sAG_GND, sheet Gyroscope/sGYRO_GND  [project net sGND]
C6/sGYRO_INT2: port sGYRO_INT2, sheet Gyroscope/sGYRO_INT2
F1/sAG_INT1: port sAG_INT1, sheet Accelerometer and Mangnetometer/sAG_INT1
F2/sAG_INT2: port sAG_INT2, sheet Accelerometer and Mangnetometer/sAG_INT2
F3/sGYRO_INT1: port sGYRO_INT1, sheet Gyroscope/sGYRO_INT1
sI2C0_SCL: R21.1 ; port sI2C0_SCL, sheet Accelerometer and Mangnetometer/sAG_SCL, sheet Gyroscope/sGYRO_SCL  [project net B2/sI2C0_SCL]
sI2C0_SDA: R25.1 ; port sI2C0_SDA, sheet Accelerometer and Mangnetometer/sAG_SDA, sheet Gyroscope/sGYRO_SDA  [project net B3/sI2C0_SDA]

### Notes on the sheet
- Layout Notes: Resistors should be placed closed to microcontroller pins.

### Library data of the parts
R21 R25 = CRCW0402xxxxFKED: 0.125W, -55-155C, 1005, 50V, ±1%

## Sheet _accel_mag.SchDoc
size Tabloid
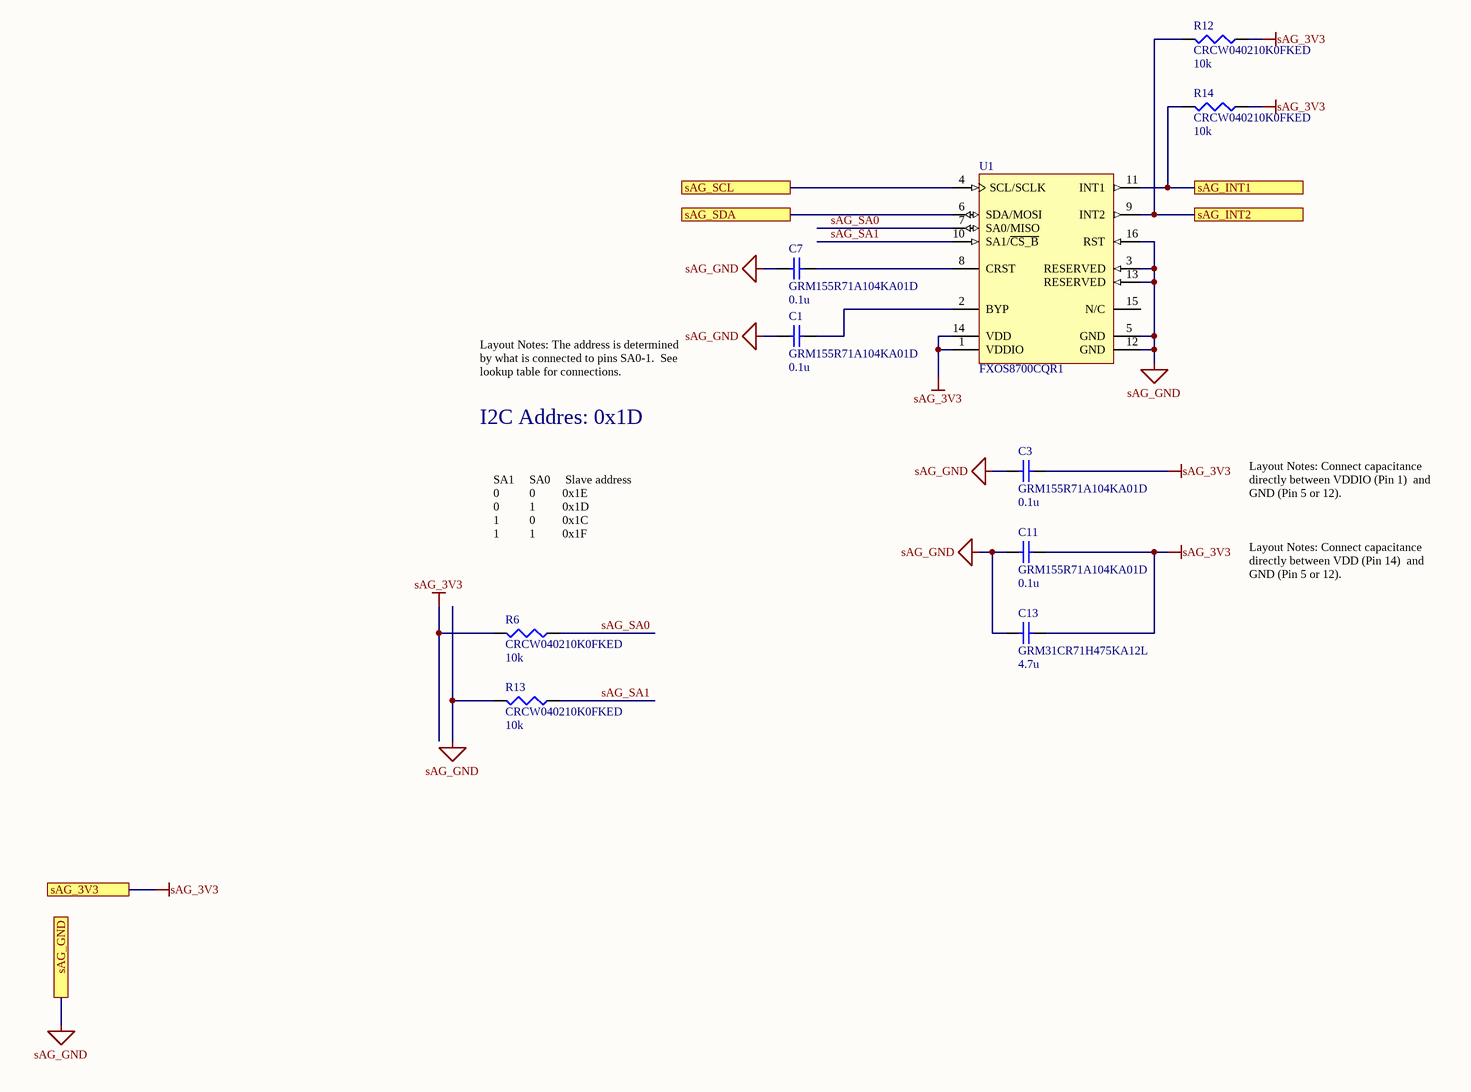
[diagram p4: _accel_mag.SchDoc]

### Parts
(Parts that share a designator on the sheet are numbered #1, #2 ... from top to bottom, then left to right.)
C1  GRM155R71A104KA01D  value 0.1u  [0402]
C3  GRM155R71A104KA01D  value 0.1u  [0402]
C7  GRM155R71A104KA01D  value 0.1u  [0402]
C11  GRM155R71A104KA01D  value 0.1u  [0402]
C13  GRM31CR71H475KA12L  value 4.7u  [1206]
R6#1  CRCW040210K0FKED  value 10k  [0402]
R12  CRCW040210K0FKED  value 10k  [0402]
R13  CRCW040210K0FKED  value 10k  [0402]
R14  CRCW040210K0FKED  value 10k  [0402]
U1  FXOS8700CQR1  [FREE-QFN-16-3000X3000DE_V]

### Ports
sAG_3V3, sAG_GND, sAG_INT1, sAG_INT2, sAG_SCL, sAG_SDA

### Nets
sAG_3V3: C3.2 C11.2 C13.2 R6#1.2 R12.1 R14.1 U1.1(VDDIO) U1.14(VDD) ; port sAG_3V3  [project net sPWR_3V3]
sAG_GND: C1.2 C3.1 C7.2 C11.1 C13.1 R13.2 U1.3(RESERVED) U1.5(GND) U1.12(GND) U1.13(RESERVED) U1.16(RST) ; port sAG_GND  [project net sGND]
B2/sI2C0_SCL: U1.4(SCL/SCLK) ; port sAG_SCL
B3/sI2C0_SDA: U1.6(SDA/MOSI) ; port sAG_SDA
F1/sAG_INT1: R14.2 U1.11(INT1) ; port sAG_INT1
F2/sAG_INT2: R12.2 U1.9(INT2) ; port sAG_INT2
sAG_SA0: R6#1.1 U1.7(SA0/MISO)
sAG_SA1: R13.1 U1.10(SA1/~{CS_B})
NetC1_1: C1.1 U1.2(BYP)
NetC7_1: C7.1 U1.8(CRST)

Not connected (* = marked no-connect by the designer): U1 15(N/C)

### Notes on the sheet
- Layout Notes: The address is determined by what is connected to pins SA0-1.  See lookup table for connections.
- I2C Addres: 0x1D
- Layout Notes: Connect capacitance directly between VDDIO (Pin 1)  and GND (Pin 5 or 12).
- SA1     SA0     Slave address
  0          0         0x1E
  0          1         0x1D
  1          0         0x1C
  1          1         0x1F
- Layout Notes: Connect capacitance directly between VDD (Pin 14)  and GND (Pin 5 or 12).

### Library data of the parts
C1 C3 C7 C11 = GRM155R71AxxxKdddd: -55-125C, 1005, 10V, X7R, ±10%
C13 = GRM31CR71HxxxKdddd: -55-125C, 3216, 50V, X7R, ±10%
R6#1 R12-R14 = CRCW0402xxxxFKED: 0.125W, -55-155C, 1005, 50V, ±1%
U1 = CMP-2000-05129-1: 6-Axis Xtrinsic Sensor with Integrated Linear Accelerometer and Magnetometer, 1.95 to 3.6 V, -40 to 85 degC, 16-Pin QFN, RoHS, Tape and Reel; Manufacturer: Freescale; Supply Voltage - Min: 1.95V; Operating Supply Voltage: 1.95Vto3.6V; Unit Weight: 0.000808oz; Supply Voltage - Max: 3.6V; Brand: FreescaleSemiconductor; Sensing Axis: X,Y,Z; Output Type: Digital; Package / Case: QFN-16; Datasheet Version: Rev. 1, 06/2012; Factory Pack Quantity: 1000; Mounting Style: SMD/SMT; Datasheet URL: https://datasheet.ciiva.com/12175/fxos8700cq-60595-12175213.pdf; Type: 6AxisSensor; Maximum Operating Temperature: +85C; Manufacturer URL: http://www.nxp.com/; Package Description: 16-Pin Quad Flat No-lead Package, Body 3 x 3 mm, Pitch 0.5 mm; RoHS: Details; Package Reference: QFN-16; Tradename: Xtrinsic; Packaging: Reel; Minimum Operating Temperature: -40C; Product Category: BoardMountAccelerationSensors

## Sheet _gyroscope.SchDoc
size Tabloid
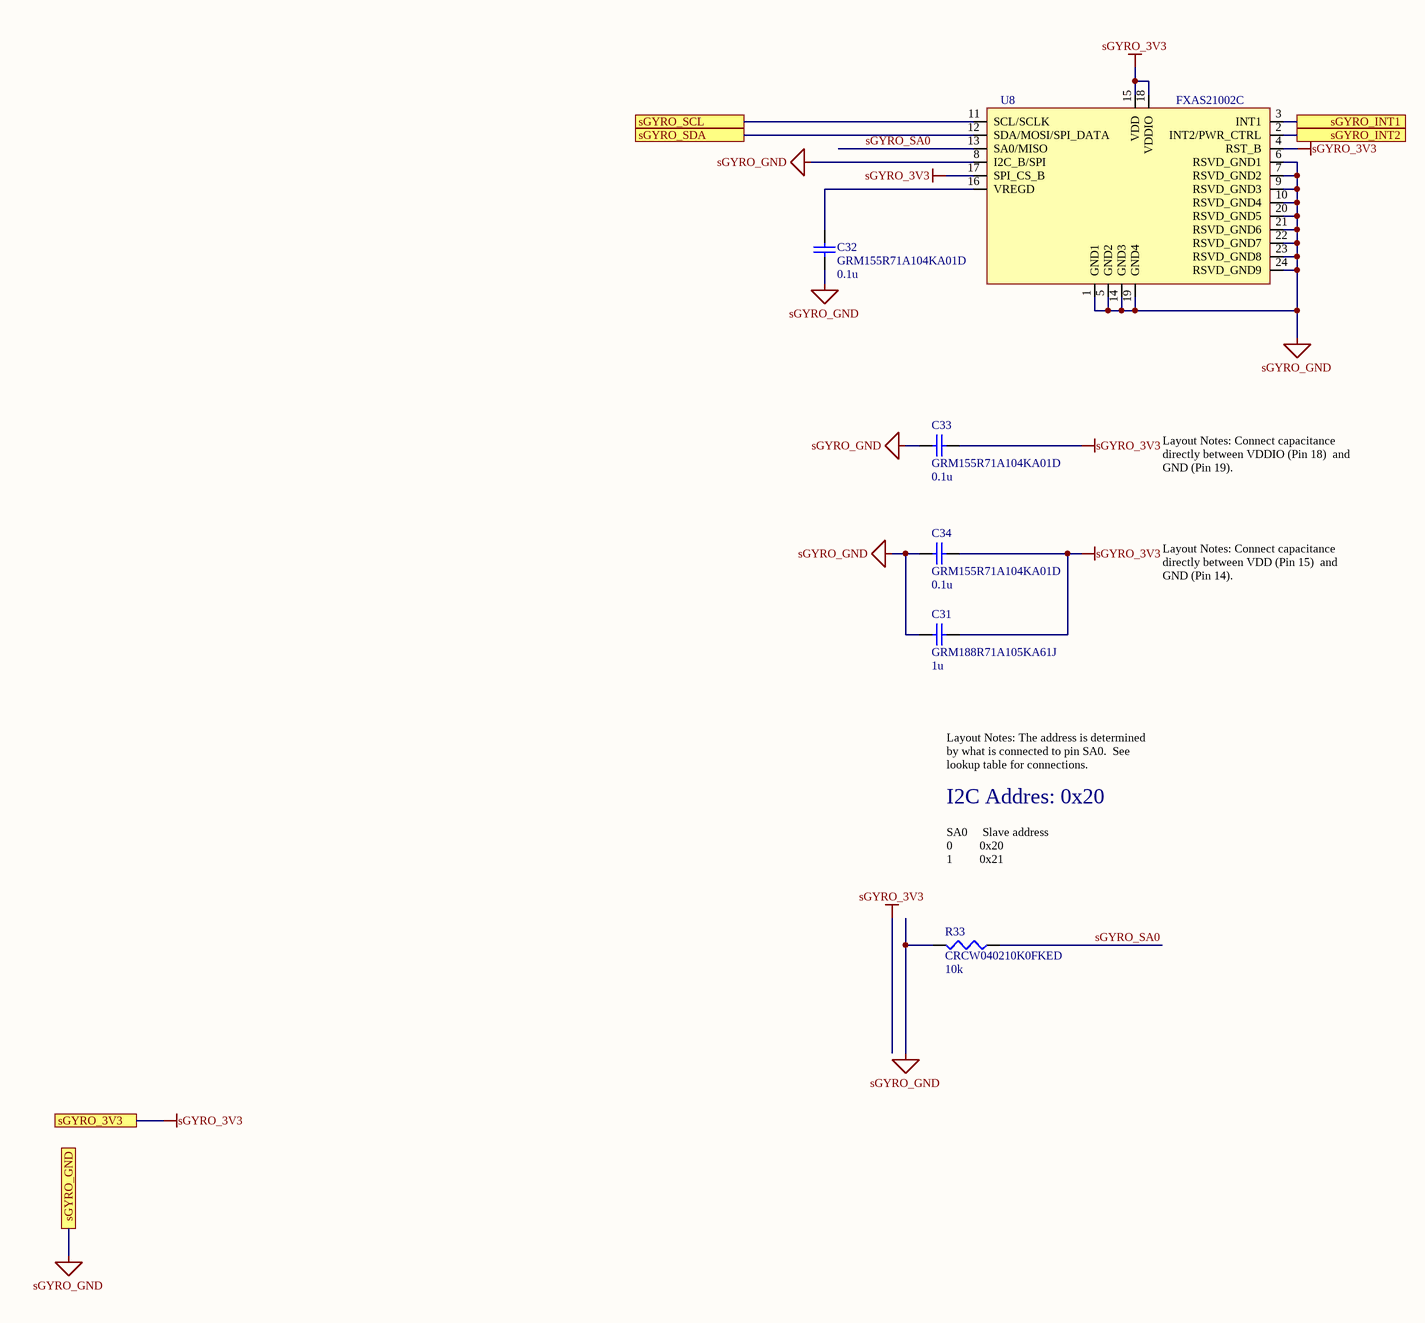
[diagram p5: _gyroscope.SchDoc]

### Parts
C31  GRM188R71A105KA61J  value 1u  [0603]
C32  GRM155R71A104KA01D  value 0.1u  [0402]
C33  GRM155R71A104KA01D  value 0.1u  [0402]
C34  GRM155R71A104KA01D  value 0.1u  [0402]
R33  CRCW040210K0FKED  value 10k  [0402]
U8  FXAS21002C  [SMD QFN 24_4X4MM 7/5]

### Ports
sGYRO_3V3, sGYRO_GND, sGYRO_INT1, sGYRO_INT2, sGYRO_SCL, sGYRO_SDA

### Nets
sGYRO_3V3: C31.1 C33.2 C34.2 U8.4(RST_B) U8.15(VDD) U8.17(SPI_CS_B) U8.18(VDDIO) ; port sGYRO_3V3  [project net sPWR_3V3]
sGYRO_GND: C31.2 C32.2 C33.1 C34.1 R33.2 U8.1(GND1) U8.5(GND2) U8.6(RSVD_GND1) U8.7(RSVD_GND2) U8.8(I2C_B/SPI) U8.9(RSVD_GND3) U8.10(RSVD_GND4) U8.14(GND3) U8.19(GND4) U8.20(RSVD_GND5) U8.21(RSVD_GND6) U8.22(RSVD_GND7) U8.23(RSVD_GND8) U8.24(RSVD_GND9) ; port sGYRO_GND  [project net sGND]
B2/sI2C0_SCL: U8.11(SCL/SCLK) ; port sGYRO_SCL
B3/sI2C0_SDA: U8.12(SDA/MOSI/SPI_DATA) ; port sGYRO_SDA
C6/sGYRO_INT2: U8.2(INT2/PWR_CTRL) ; port sGYRO_INT2
F3/sGYRO_INT1: U8.3(INT1) ; port sGYRO_INT1
sGYRO_SA0: R33.1 U8.13(SA0/MISO)
NetC32_1: C32.1 U8.16(VREGD)

### Notes on the sheet
- Layout Notes: Connect capacitance directly between VDDIO (Pin 18)  and GND (Pin 19).
- Layout Notes: Connect capacitance directly between VDD (Pin 15)  and GND (Pin 14).
- Layout Notes: The address is determined by what is connected to pin SA0.  See lookup table for connections.
- I2C Addres: 0x20
- SA0     Slave address
  0         0x20
  1         0x21

### Library data of the parts
C31 = GRM188R71AxxxKdddd: -55-125C, 1608, 10V, X7R, ±10%
C32-C34 = GRM155R71AxxxKdddd: -55-125C, 1005, 10V, X7R, ±10%
R33 = CRCW0402xxxxFKED: 0.125W, -55-155C, 1005, 50V, ±1%
U8 = FXAS21002C: 3-Axis Digital Angular Rate  Gyroscope

## Sheet _i2c1.SchDoc
size Tabloid
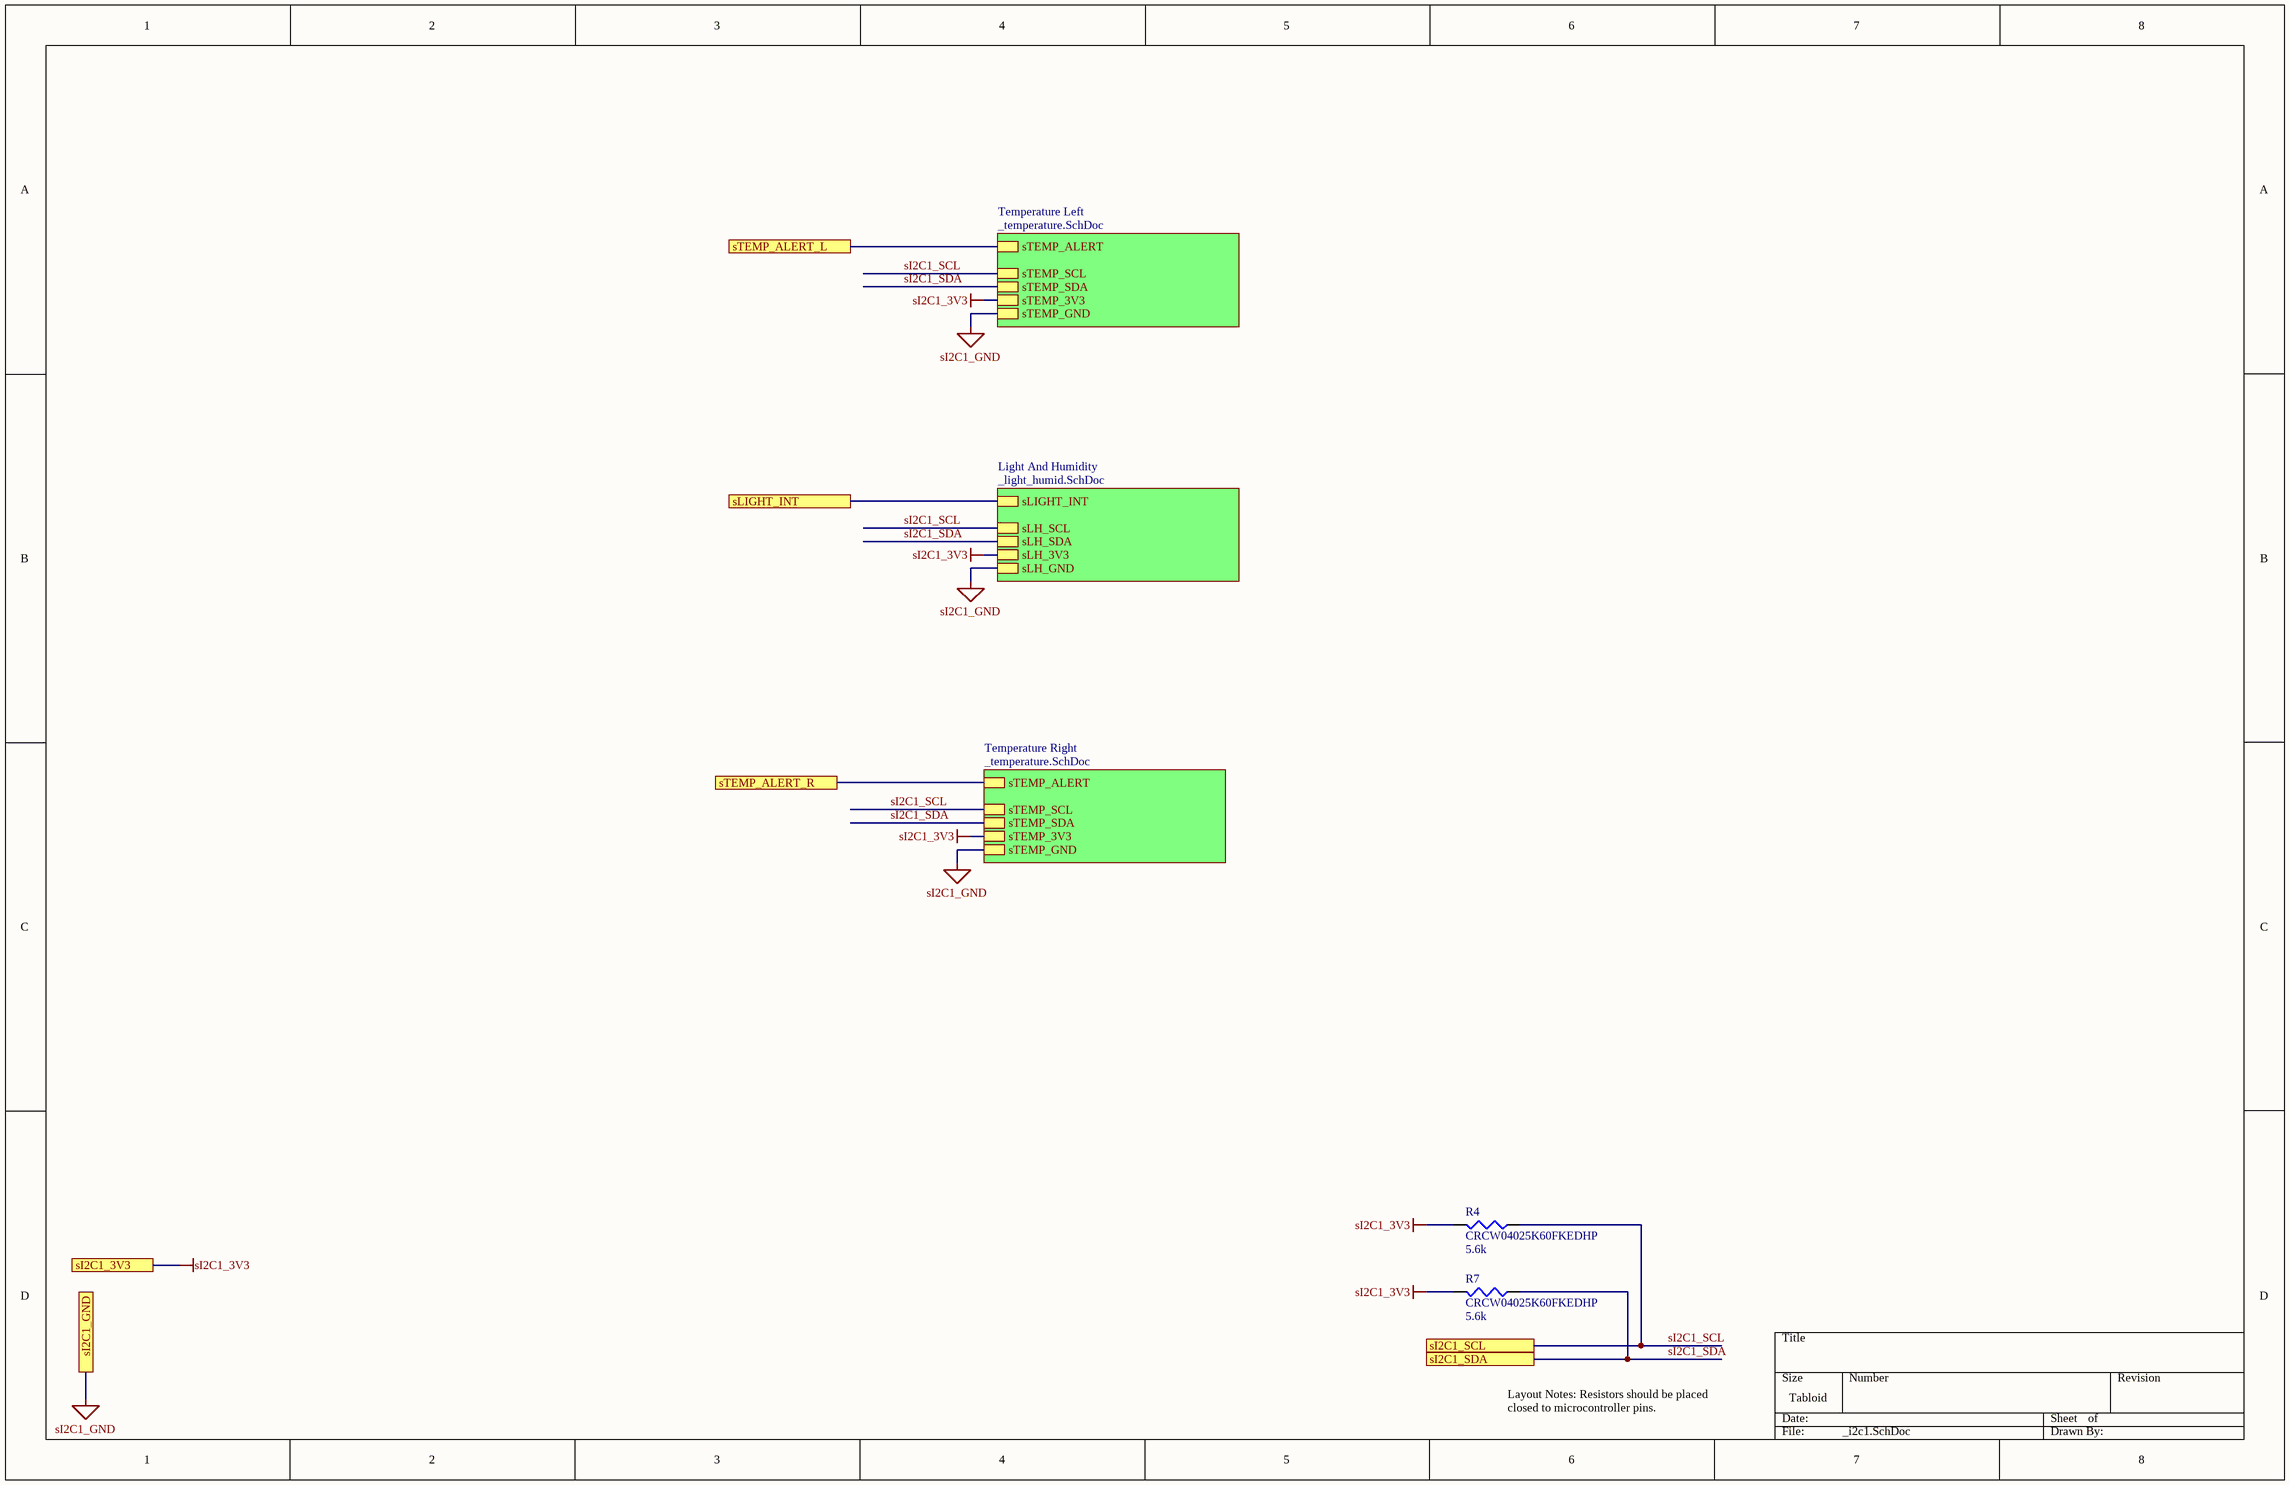
[diagram p6: _i2c1.SchDoc]

### Parts
R4  CRCW04025K60FKEDHP  value 5.6k  [0402]
R7  CRCW04025K60FKEDHP  value 5.6k  [0402]

### Sub-sheets
Light And Humidity = _light_humid.SchDoc: sLH_3V3, sLH_GND, sLH_SCL, sLH_SDA, sLIGHT_INT
Temperature Left = _temperature.SchDoc: sTEMP_3V3, sTEMP_GND, sTEMP_SCL, sTEMP_SDA, sTEMP_ALERT
Temperature Right = _temperature.SchDoc: sTEMP_3V3, sTEMP_GND, sTEMP_SCL, sTEMP_SDA, sTEMP_ALERT

### Ports
sI2C1_3V3, sI2C1_GND, sI2C1_SCL, sI2C1_SDA, sLIGHT_INT, sTEMP_ALERT_L, sTEMP_ALERT_R

### Nets
sI2C1_3V3: R4.2 R7.2 ; port sI2C1_3V3, sheet Light And Humidity/sLH_3V3, sheet Temperature Left/sTEMP_3V3, sheet Temperature Right/sTEMP_3V3  [project net sPWR_3V3]
sI2C1_GND: port sI2C1_GND, sheet Light And Humidity/sLH_GND, sheet Temperature Left/sTEMP_GND, sheet Temperature Right/sTEMP_GND  [project net sGND]
D1/sTEMP_ALERT_R: port sTEMP_ALERT_R, sheet Temperature Right/sTEMP_ALERT
D2/sLIGHT_INT: port sLIGHT_INT, sheet Light And Humidity/sLIGHT_INT
D3/sTEMP_ALERT_L: port sTEMP_ALERT_L, sheet Temperature Left/sTEMP_ALERT
sI2C1_SCL: R4.1 ; port sI2C1_SCL, sheet Light And Humidity/sLH_SCL, sheet Temperature Left/sTEMP_SCL, sheet Temperature Right/sTEMP_SCL  [project net A6/sI2C1_SCL]
sI2C1_SDA: R7.1 ; port sI2C1_SDA, sheet Light And Humidity/sLH_SDA, sheet Temperature Left/sTEMP_SDA, sheet Temperature Right/sTEMP_SDA  [project net A7/sI2C1_SDA]

### Notes on the sheet
- Layout Notes: Resistors should be placed closed to microcontroller pins.

### Library data of the parts
R4 R7 = CRCW0402xxxxFKED: 0.125W, -55-155C, 1005, 50V, ±1%

## Sheet _light_humid.SchDoc
size Tabloid
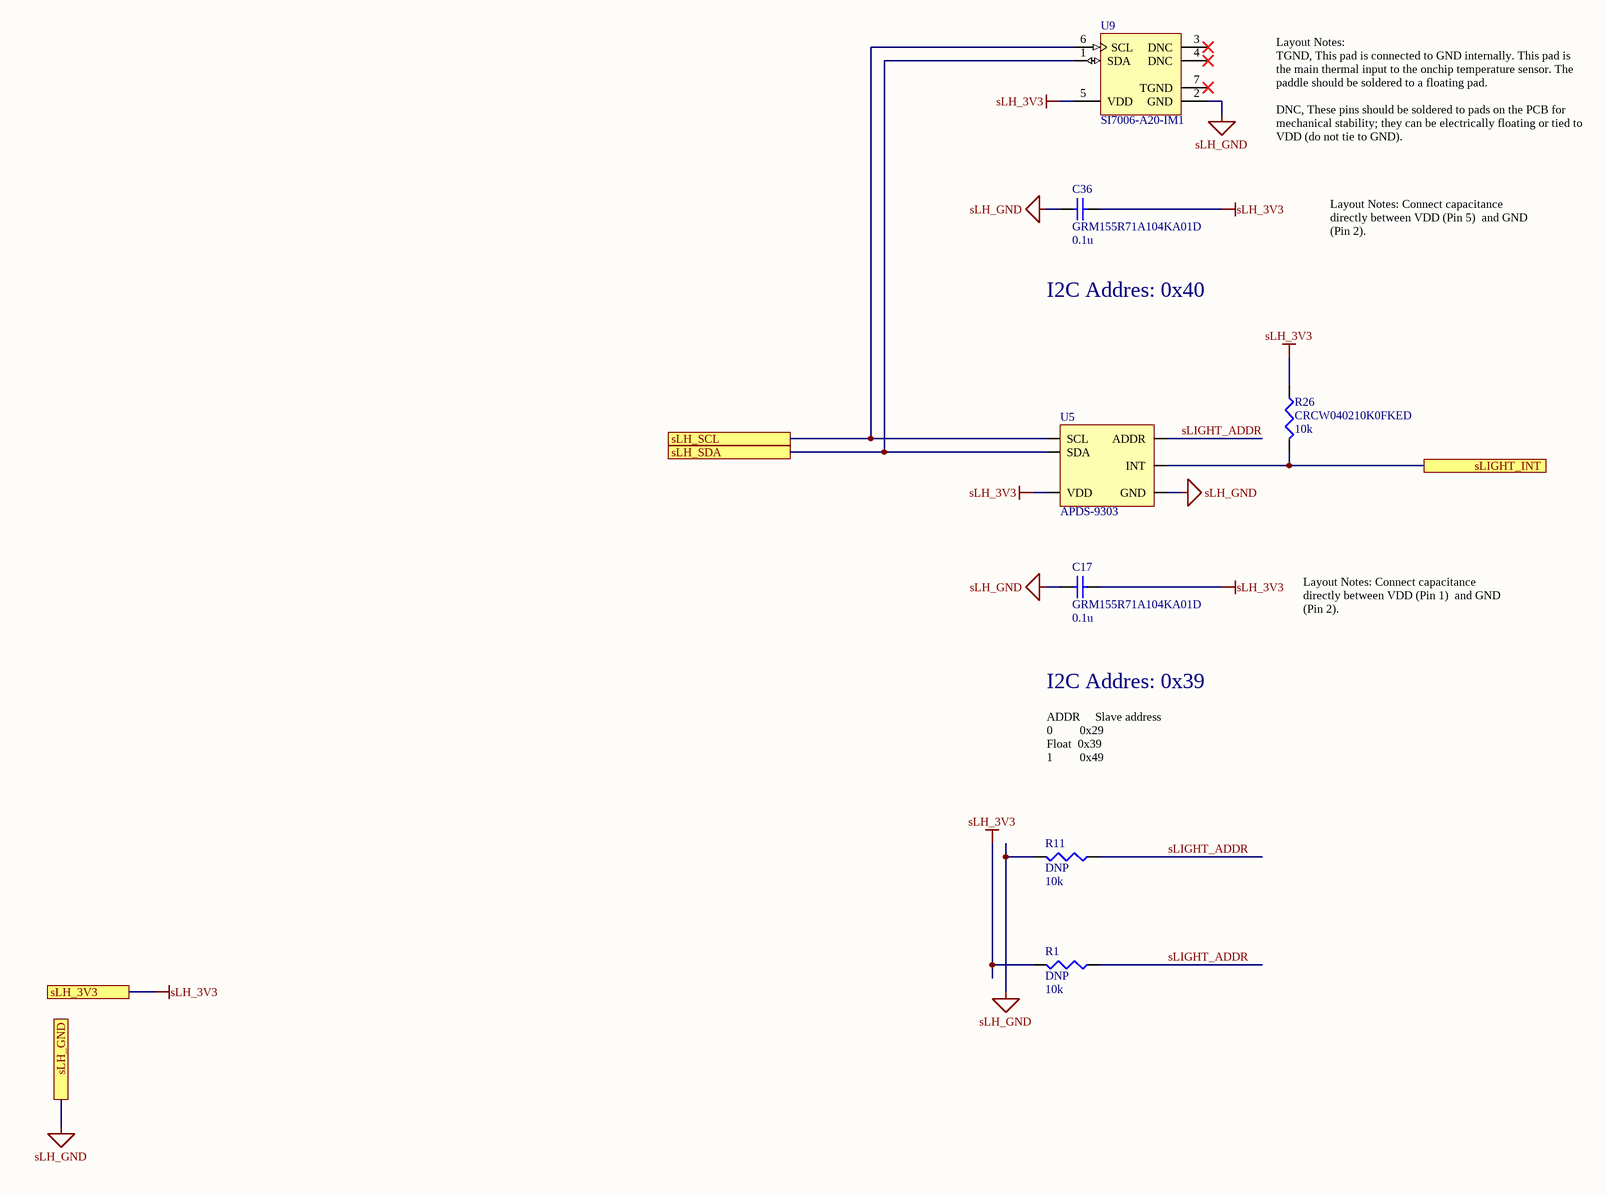
[diagram p7: _light_humid.SchDoc]

### Parts
C17  GRM155R71A104KA01D  value 0.1u  [0402]
C36  GRM155R71A104KA01D  value 0.1u  [0402]
R1  DNP  value 10k  [0402]
R11  DNP  value 10k  [0402]
R26  CRCW040210K0FKED  value 10k  [0402]
U5  APDS-9303  [APDS-9303]
U9  SI7006-A20-IM1  [SLAB-DFN-6-1500X2400TP_V]

### Ports
sLH_3V3, sLH_GND, sLH_SCL, sLH_SDA, sLIGHT_INT

### Nets
sLH_3V3: C17.2 C36.2 R1.2 R26.1 U5.1(VDD) U9.5(VDD) ; port sLH_3V3  [project net sPWR_3V3]
sLH_GND: C17.1 C36.1 R11.2 U5.2(GND) U9.2(GND) ; port sLH_GND  [project net sGND]
A6/sI2C1_SCL: U5.4(SCL) U9.6(SCL) ; port sLH_SCL
A7/sI2C1_SDA: U5.5(SDA) U9.1(SDA) ; port sLH_SDA
D2/sLIGHT_INT: R26.2 U5.6(INT) ; port sLIGHT_INT
sLIGHT_ADDR: R1.1 R11.1 U5.3(ADDR)

Not connected (* = marked no-connect by the designer): U9 3(DNC)* 4(DNC)* 7(TGND)*

### Notes on the sheet
- Layout Notes:
  TGND, This pad is connected to GND internally. This pad is the main thermal input to the onchip temperature sensor. The paddle should be soldered to a floating pad.
  DNC, These pins should be soldered to pads on the PCB for mechanical stability; they can be electrically floating or tied to VDD (do not tie to GND).
- Layout Notes: Connect capacitance directly between VDD (Pin 5)  and GND (Pin 2).
- I2C Addres: 0x40
- Layout Notes: Connect capacitance directly between VDD (Pin 1)  and GND (Pin 2).
- I2C Addres: 0x39
- ADDR     Slave address
  0         0x29
  Float  0x39
  1         0x49

### Library data of the parts
C17 C36 = GRM155R71AxxxKdddd: -55-125C, 1005, 10V, X7R, ±10%
R1 R11 R26 = CRCW0402xxxxFKED: 0.125W, -55-155C, 1005, 50V, ±1%
U9 = CMP-2000-07060-1: I2C Humidity and Temperature Sensor, 1.9 to 3.6 V, -40 to 125 degC, 6-Pin DFN, RoHS, Tube; Manufacturer: Silicon Labs; Output Type: Digital; Resolution: 12(Humidity)bit,14(Temperature)bit; Minimum Operating Supply Voltage: 1.9V; Sensor Function: Temperature&Humidity; Accuracy: ±1°C,±5%RH; Maximum Operating Supply Voltage: 3.6V; Pin Count: 6; Maximum Operating Temperature: +125°C; Package Reference: DFN-6; Height: 0.75mm; Datasheet URL: https://www.silabs.com/Support%20Documents%2FTechnicalDocs%2FSi7006-A20.pdf; Datasheet Version: Rev. 1.1, 06/2015; Package Type: DFN; Mounting Technology: SurfaceMount; Dimensions: 3x3x0.75mm; Length: 3mm; Package Description: 6-Pin Small Outline No-Lead Package, Body 3 x 3 mm, Pitch 1 mm; Minimum Operating Temperature: -40°C; Interface Type: I2C; Mounting Type: SurfaceMount; Width: 3mm; Manufacturer URL: http://www.silabs.com/

## Sheet _temperature.SchDoc
size Tabloid
Used 2 times, as channels I2C 1/Temperature Left, I2C 1/Temperature Right. Parts and nets are listed once, with the designators drawn on the sheet.
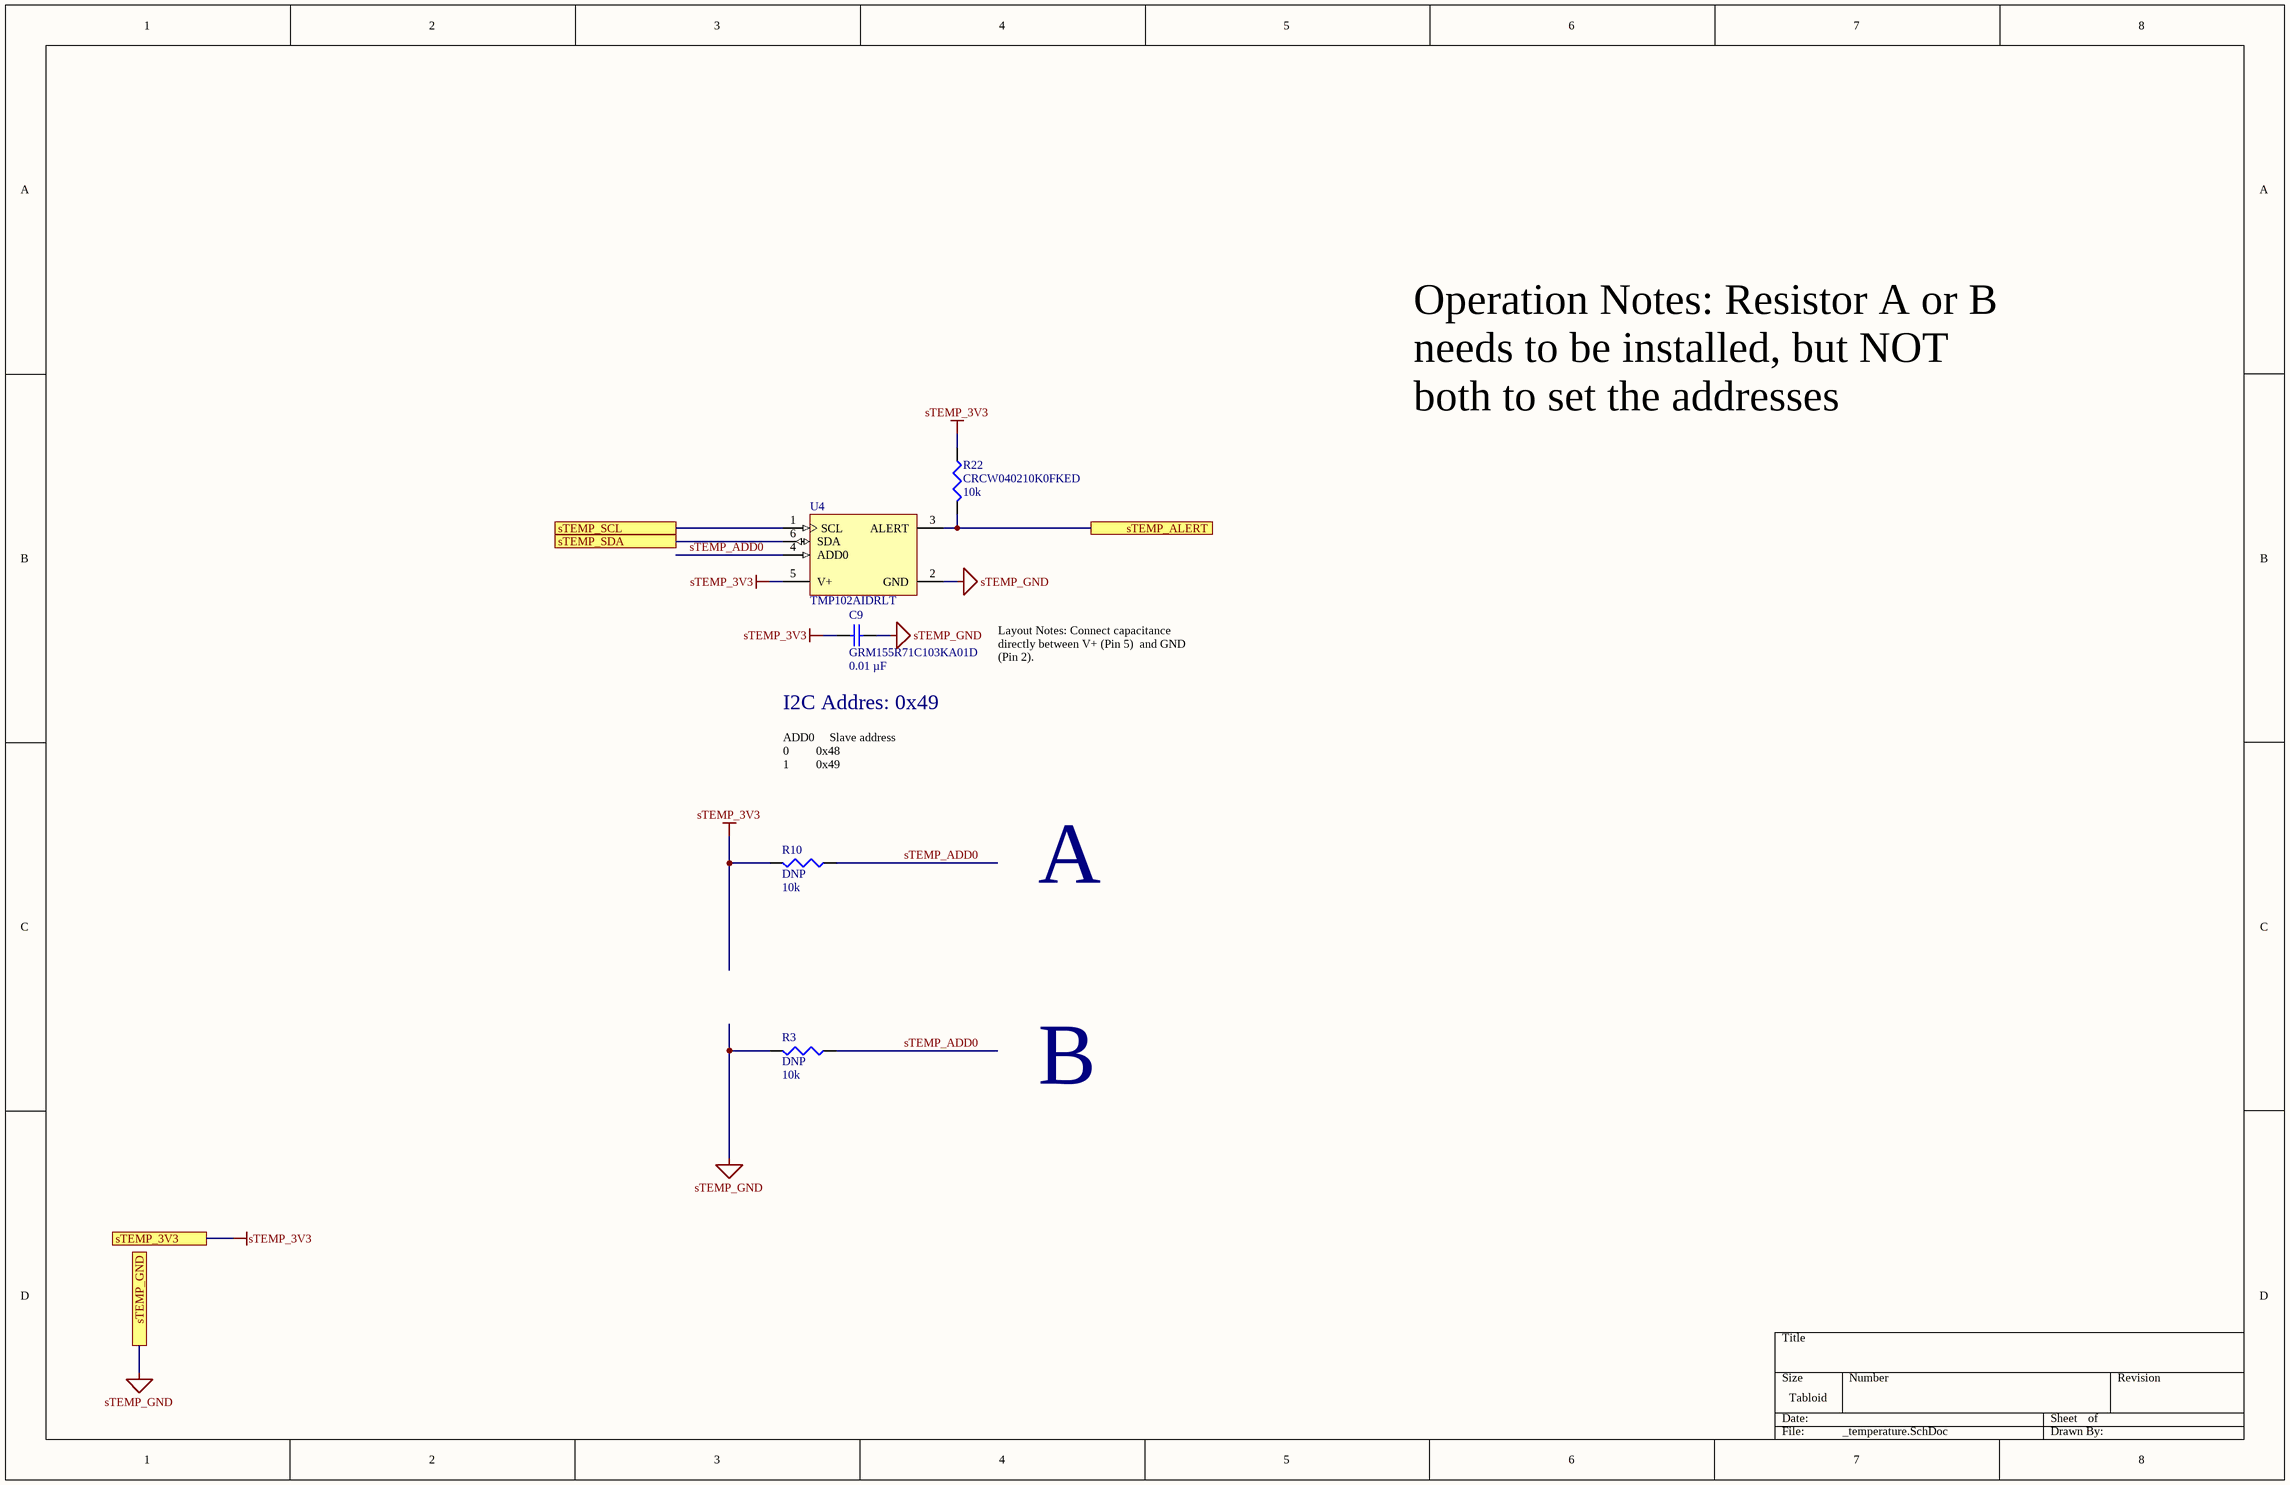
[diagram p8: _temperature.SchDoc]

### Parts
C9  GRM155R71C103KA01D  value 0.01 µF  [0402]
R3  DNP  value 10k  [0402]
R10  DNP  value 10k  [0402]
R22  CRCW040210K0FKED  value 10k  [0402]
U4  TMP102AIDRLT  [DRL0006A_L]

### Ports
sTEMP_3V3, sTEMP_ALERT, sTEMP_GND, sTEMP_SCL, sTEMP_SDA

### Nets
sTEMP_3V3: C9.2 R10.2 R22.1 U4.5(V+) ; port sTEMP_3V3
sTEMP_GND: C9.1 R3.2 U4.2(GND) ; port sTEMP_GND
sTEMP_ADD0: R3.1 R10.1 U4.4(ADD0)
sTEMP_ALERT: R22.2 U4.3(ALERT) ; port sTEMP_ALERT
sTEMP_SCL: U4.1(SCL) ; port sTEMP_SCL
sTEMP_SDA: U4.6(SDA) ; port sTEMP_SDA

### Channels
I2C 1/Temperature Left: designators C9=C38#2 R3=R6#2 R10=R36#2 R22=R42 U4=U10; ports sTEMP_3V3=sPWR_3V3 sTEMP_ALERT=D3/sTEMP_ALERT_L sTEMP_GND=sGND sTEMP_SCL=A6/sI2C1_SCL sTEMP_SDA=A7/sI2C1_SDA
I2C 1/Temperature Right: designators end in _Temperature_Right; ports sTEMP_3V3=sPWR_3V3 sTEMP_ALERT=D1/sTEMP_ALERT_R sTEMP_GND=sGND sTEMP_SCL=A6/sI2C1_SCL sTEMP_SDA=A7/sI2C1_SDA

### Notes on the sheet
- Operation Notes: Resistor A or B needs to be installed, but NOT both to set the addresses
- Layout Notes: Connect capacitance directly between V+ (Pin 5)  and GND (Pin 2).
- I2C Addres: 0x49
- ADD0     Slave address
  0         0x48
  1         0x49
- A
- B

### Library data of the parts
C9 = Cap: Cap, 0.01 µF, 16 V, X7R; Published: 8-Jun-2000; LatestRevisionDate: 17-Jul-2002; LatestRevisionNote: Re-released for DXP Platform.; PackageReference: RAD-0.3; Publisher: Altium Limited; PackageDescription: Radial Cap, Thru-Hole; 2 Leads; 0.3 in Pin Spacing
R3 R10 R22 = CRCW0402xxxxFKED: 0.125W, -55-155C, 1005, 50V, ±1%
U4 = CMP-1685-00013-1: Low Power Digital Temperature Sensor with SMBus and Two-Wire Serial Interface, 1.4 to 3.6 V, -40 to 125 degC, 6-Pin SOT (DRL), Green (RoHS & no Sb/Br), Tape and Reel; ComponentLink3URL: http://www.ti.com/lit/ml/mpds159c/mpds159c.pdf; PackageVersion: 4205622-3/D, 08/2207; ComponentLink2Description: Datasheet; PackageReference: DRL0006A; ComponentLink2URL: http://www.ti.com/lit/ds/symlink/tmp102.pdf; ComponentLink3Description: Package Specification; ComponentLink1Description: Manufacturer URL; DatasheetVersion: SBOS397F, 12/2015; PackageDescription: 6-Pin Plastic Small Outline, Body 1.6 x 1.2 mm, Pitch 0.5 mm; ComponentLink1URL: http://www.ti.com/

## Sheet _io.SchDoc
size Tabloid
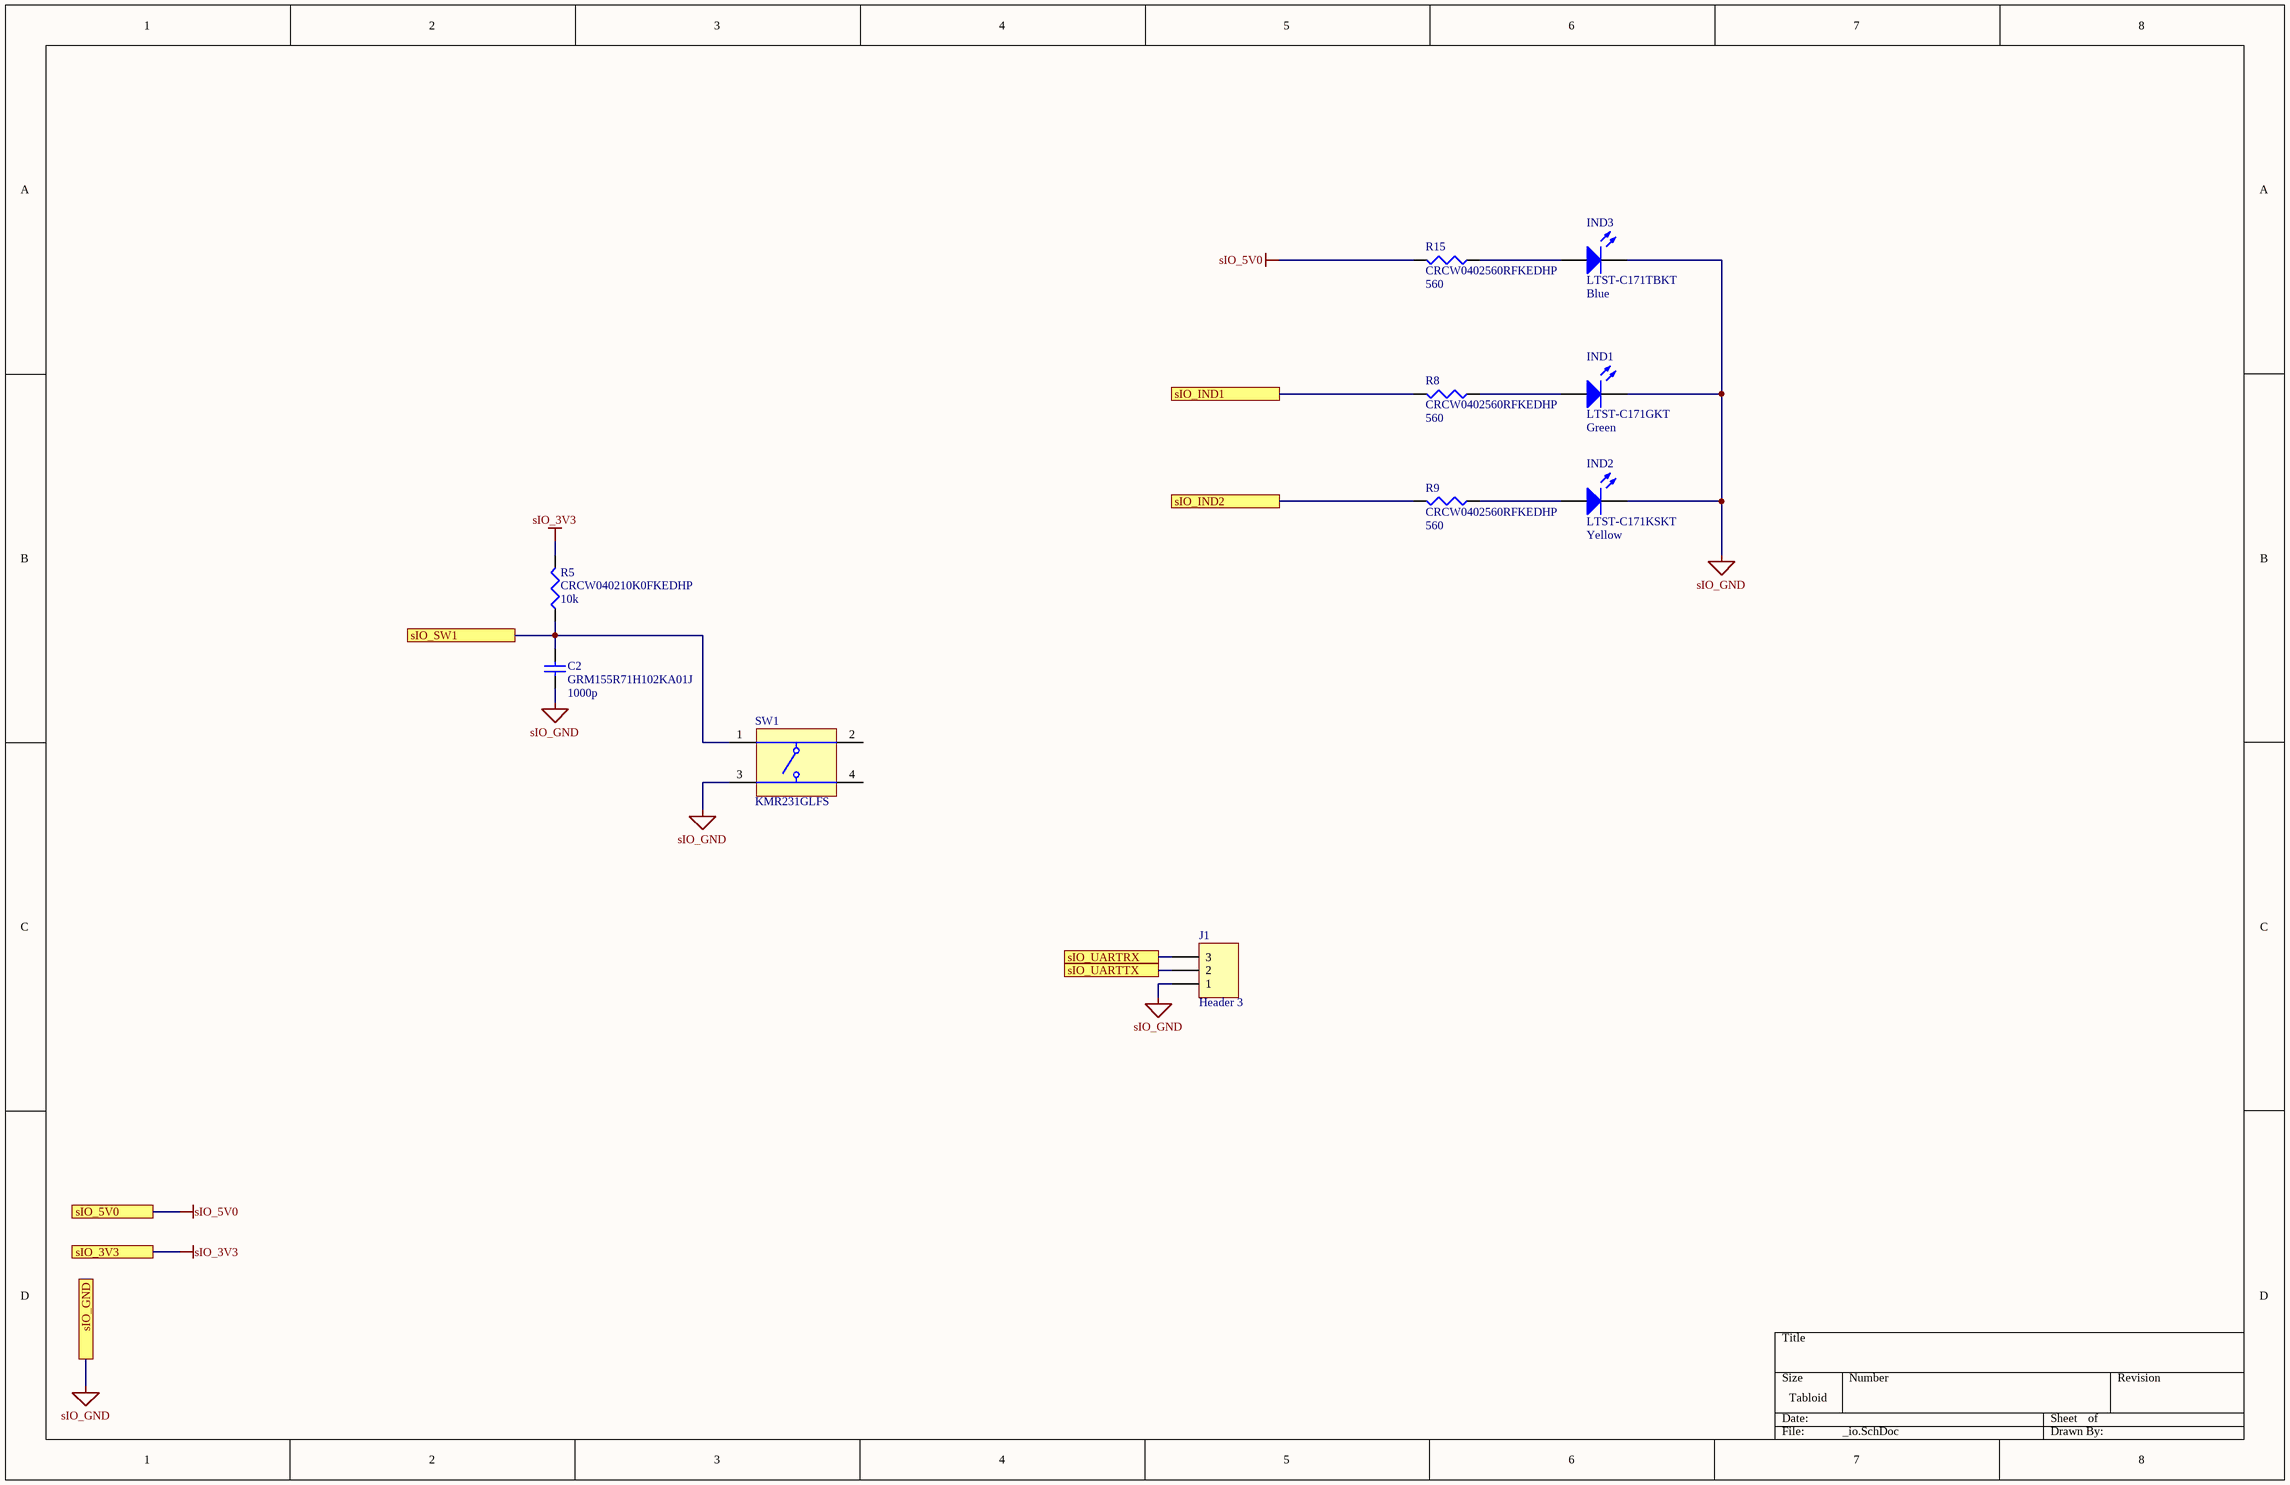
[diagram p9: _io.SchDoc]

### Parts
C2  GRM155R71H102KA01J  value 1000p  [0402]
IND1  LTST-C171GKT  Color: Green  [0805]
IND2  LTST-C171KSKT  Color: Yellow  [0805]
IND3  LTST-C171TBKT  Color: Blue  [0805]
J1  Header 3  [HDR1X3]
R5  CRCW040210K0FKEDHP  value 10k  [0402]
R8  CRCW0402560RFKEDHP  value 560  [0402]
R9  CRCW0402560RFKEDHP  value 560  [0402]
R15  CRCW0402560RFKEDHP  value 560  [0402]
SW1  KMR231GLFS  [KMR231GLFS]

### Ports
sIO_3V3, sIO_5V0, sIO_GND, sIO_IND1, sIO_IND2, sIO_SW1, sIO_UARTRX, sIO_UARTTX

### Nets
sIO_3V3: R5.2 ; port sIO_3V3  [project net sPWR_3V3]
sIO_5V0: R15.2 ; port sIO_5V0  [project net sPWR_5V0]
sIO_GND: C2.1 IND1.2(K) IND2.2(K) IND3.2(K) J1.1 SW1.3 ; port sIO_GND  [project net sGND]
A0/sIO_UARTRX: J1.2 ; port sIO_UARTTX
A1/sIO_UARTTX: J1.3 ; port sIO_UARTRX
C4/sIO_IND1: R8.2 ; port sIO_IND1
C5/sIO_IND2: R9.2 ; port sIO_IND2
F4/sIO_SW1: C2.2 R5.1 SW1.1 ; port sIO_SW1
NetIND1_1: IND1.1(A) R8.1
NetIND2_1: IND2.1(A) R9.1
NetIND3_1: IND3.1(A) R15.1

Not connected (* = marked no-connect by the designer): SW1 2 4

### Library data of the parts
C2 = GRM155R71HxxxKdddd: -55-125C, 1005, 50V, X7R, ±10%
IND1 IND3 = LTST-C171GKT: LED
IND2 = LTST-C171KSKT: LED
J1 = Header 3: Header, 3-Pin; LatestRevisionDate: 17-Jul-2002; LatestRevisionNote: Re-released for DXP Platform.; Publisher: Altium Limited
R5 R8 R9 R15 = CRCW0402xxxxFKED: 0.125W, -55-155C, 1005, 50V, ±1%
SW1 = KMR231GLFS: as RESET on sheet _microcontroller; Operating Temperature: -40to85C; Electrical Life: N/A; Housing Material: N/A; ECCN: EAR99; Pole Throw Configuration: SPST; Contact Plating: Silver; Dimension: 2.8x4.6x1.9mm; Type: Micro-Miniature; Product Weight: N/A; Package Description: 4-Pin Surface Mount Device, Body 4.6 x 2.8 mm; Actuator Color: N/A; HTS: 8536501199; Mounting Technology: SurfaceMount; Mounting: SurfaceMount,GullWing; Seal Location: N/A; Base Material: N/A; Family: KMR2; Part No: KMR231GLFS; Datasheet Version: 06/2016; Contact Material: Silver; Package Reference: KMR231GLFS; Manufacturer URL: http://www.ckswitches.com/; Maximum AC Voltage Rating: N/A; Datasheet URL: http://www.ck-components.com/media/1479/kmr2.pdf; RoHS: Yes; Seal Description: N/A; Packaging: TapeandReel; Supplier: C&KComponents

## Sheet _spi0.SchDoc
size Tabloid
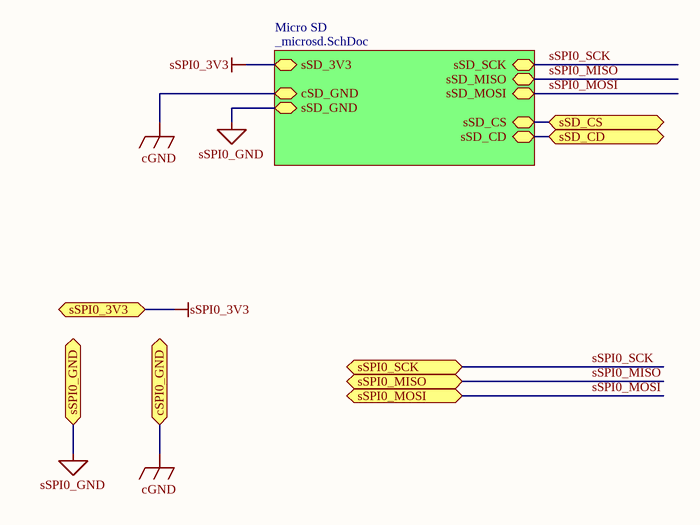
[diagram p10: _spi0.SchDoc]

### Sub-sheets
Micro SD = _microsd.SchDoc: sSD_3V3, sSD_GND, cSD_GND, sSD_SCK, sSD_MISO, sSD_MOSI, sSD_CD, sSD_CS

### Ports
cSPI0_GND, sSD_CD, sSD_CS, sSPI0_3V3, sSPI0_GND, sSPI0_MISO, sSPI0_MOSI, sSPI0_SCK

### Nets
cGND: port cSPI0_GND, sheet Micro SD/cSD_GND
sSPI0_3V3: port sSPI0_3V3, sheet Micro SD/sSD_3V3  [project net sPWR_3V3]
sSPI0_GND: port sSPI0_GND, sheet Micro SD/sSD_GND  [project net sGND]
A3/sSD_CS: port sSD_CS, sheet Micro SD/sSD_CS
C7/sSD_CD: port sSD_CD, sheet Micro SD/sSD_CD
sSPI0_MISO: port sSPI0_MISO, sheet Micro SD/sSD_MISO  [project net A4/sSPI0_MISO]
sSPI0_MOSI: port sSPI0_MOSI, sheet Micro SD/sSD_MOSI  [project net A5/sSPI0_MOSI]
sSPI0_SCK: port sSPI0_SCK, sheet Micro SD/sSD_SCK  [project net A2/SPI0_SCK]

## Sheet _microsd.SchDoc
size Tabloid
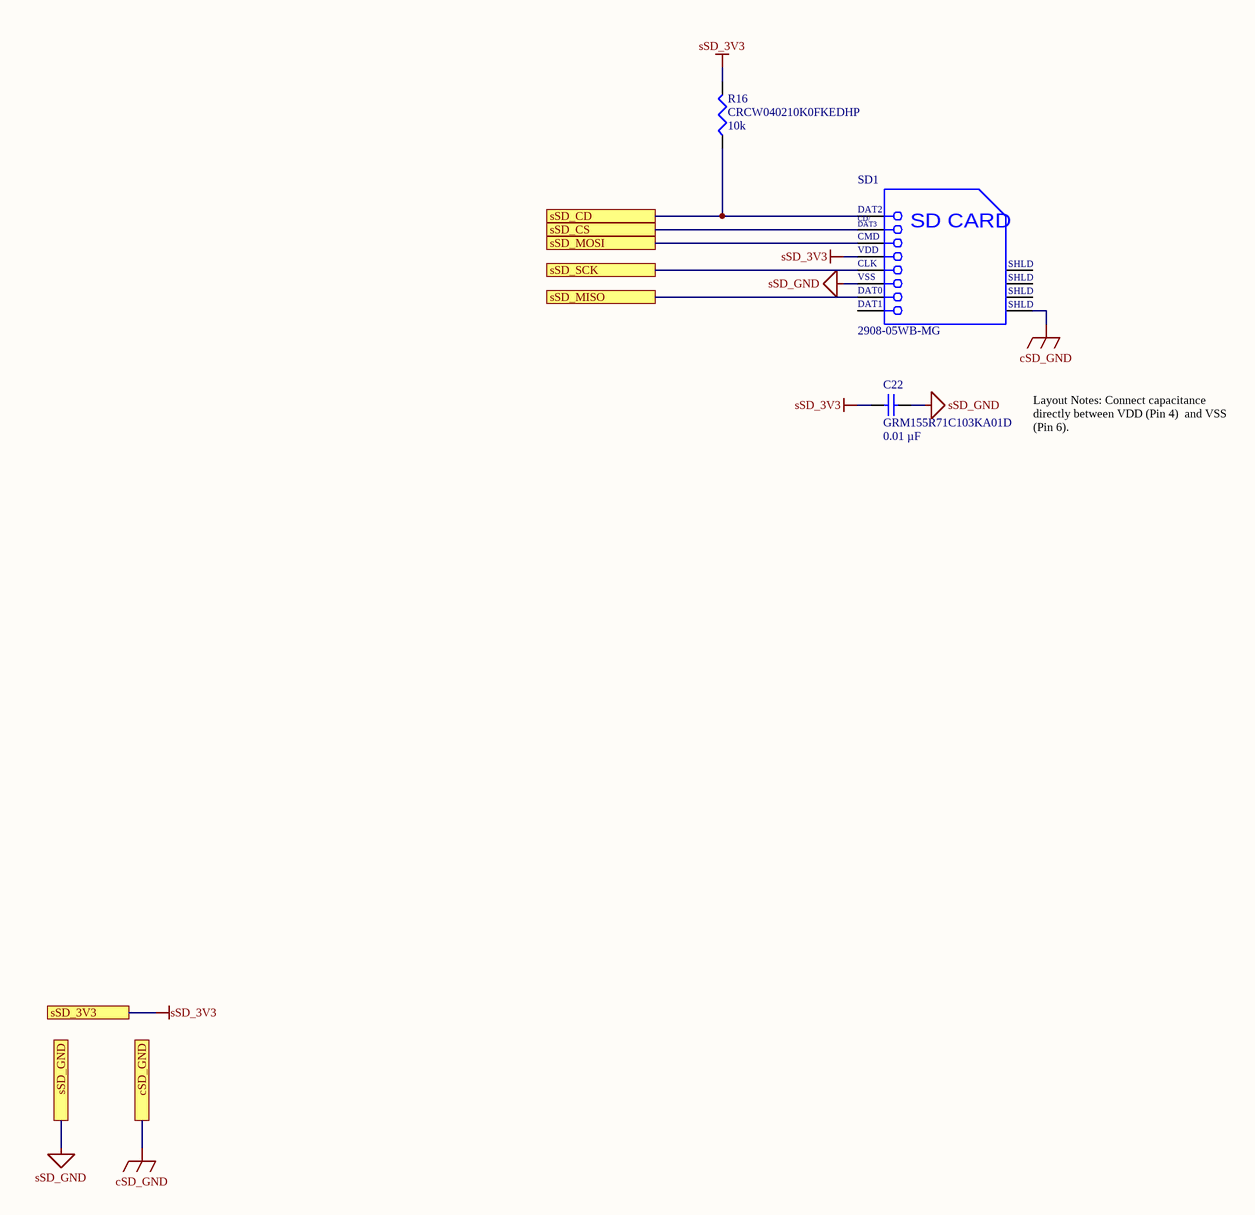
[diagram p11: _microsd.SchDoc]

### Parts
C22  GRM155R71C103KA01D  value 0.01 µF  [0402]
R16  CRCW040210K0FKEDHP  value 10k  [0402]
SD1  2908-05WB-MG  [3M-2908-05WB-MG_V]

### Ports
cSD_GND, sSD_3V3, sSD_CD, sSD_CS, sSD_GND, sSD_MISO, sSD_MOSI, sSD_SCK

### Nets
cSD_GND: SD1.12(SHLD) ; port cSD_GND  [project net cGND]
sSD_3V3: C22.2 R16.2 SD1.4(VDD) ; port sSD_3V3  [project net sPWR_3V3]
sSD_GND: C22.1 SD1.6(VSS) ; port sSD_GND  [project net sGND]
A2/SPI0_SCK: SD1.5(CLK) ; port sSD_SCK
A3/sSD_CS: SD1.2(CD/DAT3) ; port sSD_CS
A4/sSPI0_MISO: SD1.7(DAT0) ; port sSD_MISO
A5/sSPI0_MOSI: SD1.3(CMD) ; port sSD_MOSI
C7/sSD_CD: R16.1 SD1.1(DAT2) ; port sSD_CD

Not connected (* = marked no-connect by the designer): SD1 8(DAT1) 9(SHLD) 10(SHLD) 11(SHLD)

### Notes on the sheet
- Layout Notes: Connect capacitance directly between VDD (Pin 4)  and VSS (Pin 6).
- (in symbol CMP-2000-05030-1) CD/; DAT3; SD CARD

### Library data of the parts
C22 = Cap: Cap, 0.01 µF, 16 V, X7R; Published: 8-Jun-2000; LatestRevisionDate: 17-Jul-2002; LatestRevisionNote: Re-released for DXP Platform.; PackageReference: RAD-0.3; Publisher: Altium Limited; PackageDescription: Radial Cap, Thru-Hole; 2 Leads; 0.3 in Pin Spacing
R16 = CRCW0402xxxxFKED: 0.125W, -55-155C, 1005, 50V, ±1%
SD1 = CMP-2000-05030-1: Card Connector Micro-SD, 500 VAC, 100 mOhm Min, 0.5 A, RoHS, Tape and Reel; Manufacturer: 3M; Connector Type: ConnectorandEjector; Other Related Documents: SDCardDateCodeDecipher; Insertion, Removal Method: PushIn,PushOut; Other Names: 3M5607CT; PCN Obsolescence/ EOL: 2908Series30/Jun/2010; Number of Positions: 10(8+2); Card Type: SecureDigital-microSD™; Online Catalog: 2900Series; Featured Product: 3MCardConnectormicroSD; Features: Switch; Packaging: CutTape(CT); Package Reference: 2908-05WB-MG; Package Description: 8-Pin Surface Mount Device, Body 15.2 x 14 mm, Pitch 1.1 mm; Contact Finish: Gold; Catalog Drawings: 2908-05WB-MG; Mounting Feature: Normal,Standard-Top; Series: 2900; Datasheet Version: Oct-06; Datasheet URL: http://datasheet.octopart.com/2908-05WB-MG-3M-datasheet-6398107.pdf; Contact Finish Thickness: 15µin(0.38µm); Manufacturer URL: http://www.3m.com/; Family: MemoryConnectors-PCCardSockets; Category: Connectors,Interconnects; Standard Package: 1; Mounting Type: SurfaceMount,RightAngle; Ejector Side: -

## Nets that join several sheets
cGND: _power (C21.2 J2.8 R17.2), _microsd (SD1.12)
sGND: _microcontroller (30 pins), _power (23 pins), _accel_mag (11 pins), _gyroscope (19 pins), _light_humid (5 pins), I2C 1/Temperature Left (C38#2.1 R6#2.2 U10.2), I2C 1/Temperature Right (C9_Temperature_Right.1 R3_Temperature_Right.2 U4_Temperature_Right.2), _io (6 pins), _microsd (C22.1 SD1.6)
sPWR_3V3: _microcontroller (16 pins), _power (8 pins), _i2c0 (R21.2 R25.2), _accel_mag (8 pins), _gyroscope (7 pins), _i2c1 (R4.2 R7.2), _light_humid (6 pins), I2C 1/Temperature Left (C38#2.2 R36#2.2 R42.1 U10.5), I2C 1/Temperature Right (C9_Temperature_Right.2 R10_Temperature_Right.2 R22_Temperature_Right.1 U4_Temperature_Right.5), _io (R5.2), _microsd (C22.2 R16.2 SD1.4)
sPWR_3V7: _microcontroller (R32.1 R41.2), _power (5 pins)
sPWR_5V0: _microcontroller (U2.46), _power (6 pins), _io (R15.2)
A0/sIO_UARTRX: _microcontroller (U2.17), _io (J1.2)
A1/sIO_UARTTX: _microcontroller (U2.18), _io (J1.3)
A2/SPI0_SCK: _microcontroller (U2.19), _microsd (SD1.5)
A3/sSD_CS: _microcontroller (U2.20), _microsd (SD1.2)
A4/sSPI0_MISO: _microcontroller (U2.21), _microsd (SD1.7)
A5/sSPI0_MOSI: _microcontroller (U2.22), _microsd (SD1.3)
A6/sI2C1_SCL: _microcontroller (U2.23), _i2c1 (R4.1), _light_humid (U5.4 U9.6), I2C 1/Temperature Left (U10.1), I2C 1/Temperature Right (U4_Temperature_Right.1)
A7/sI2C1_SDA: _microcontroller (U2.24), _i2c1 (R7.1), _light_humid (U5.5 U9.1), I2C 1/Temperature Left (U10.6), I2C 1/Temperature Right (U4_Temperature_Right.6)
B2/sI2C0_SCL: _microcontroller (U2.47), _i2c0 (R21.1), _accel_mag (U1.4), _gyroscope (U8.11)
B3/sI2C0_SDA: _microcontroller (U2.48), _i2c0 (R25.1), _accel_mag (U1.6), _gyroscope (U8.12)
C4/sIO_IND1: _microcontroller (U2.16), _io (R8.2)
C5/sIO_IND2: _microcontroller (U2.15), _io (R9.2)
C6/sGYRO_INT2: _microcontroller (U2.14), _gyroscope (U8.2)
C7/sSD_CD: _microcontroller (U2.13), _microsd (R16.1 SD1.1)
D0/sBMS_MODE: _microcontroller (U2.61), _power (R23.2 U6.3)
D1/sTEMP_ALERT_R: _microcontroller (U2.62), I2C 1/Temperature Right (R22_Temperature_Right.2 U4_Temperature_Right.3)
D2/sLIGHT_INT: _microcontroller (U2.63), _light_humid (R26.2 U5.6)
D3/sTEMP_ALERT_L: _microcontroller (U2.64), I2C 1/Temperature Left (R42.2 U10.3)
D4/sUSB_DATA_N: _microcontroller (U2.43), _power (R20.2)
D5/sUSB_DATA_P: _microcontroller (U2.44), _power (R24.2)
E0/sBMS_~{SHDN}: _microcontroller (U2.9), _power (U7.8)
E1/sBMS_~{CHRG}: _microcontroller (U2.8), _power (R19.2 U7.1)
E2/sBMS_~{ACPR}: _microcontroller (U2.7), _power (R38.2 U7.10)
E3/sBMS~{_FAULT}: _microcontroller (U2.6), _power (R18.2 U7.3)
F1/sAG_INT1: _microcontroller (U2.29), _accel_mag (R14.2 U1.11)
F2/sAG_INT2: _microcontroller (U2.30), _accel_mag (R12.2 U1.9)
F3/sGYRO_INT1: _microcontroller (U2.31), _gyroscope (U8.3)
F4/sIO_SW1: _microcontroller (U2.5), _io (C2.2 R5.1 SW1.1)
s~{HIB}: _microcontroller (U2.33), _power (U3.6)